# EasyEDA Pro project logic_G1.epro, board PCB2
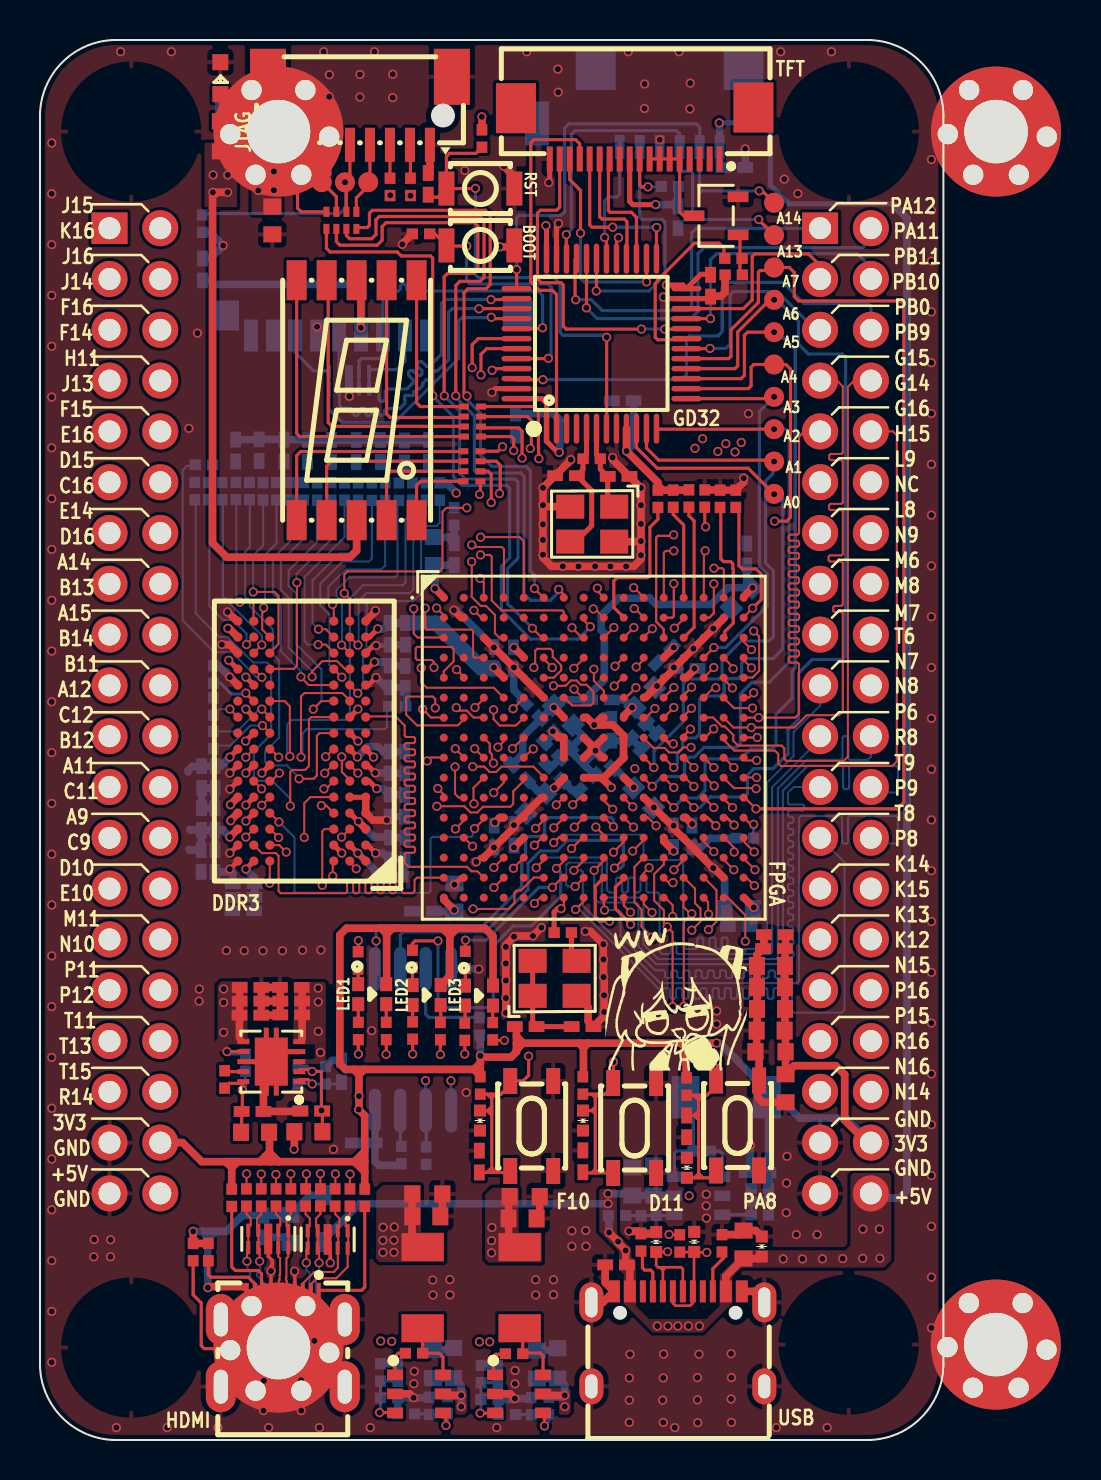
[diagram p10: board, top side]
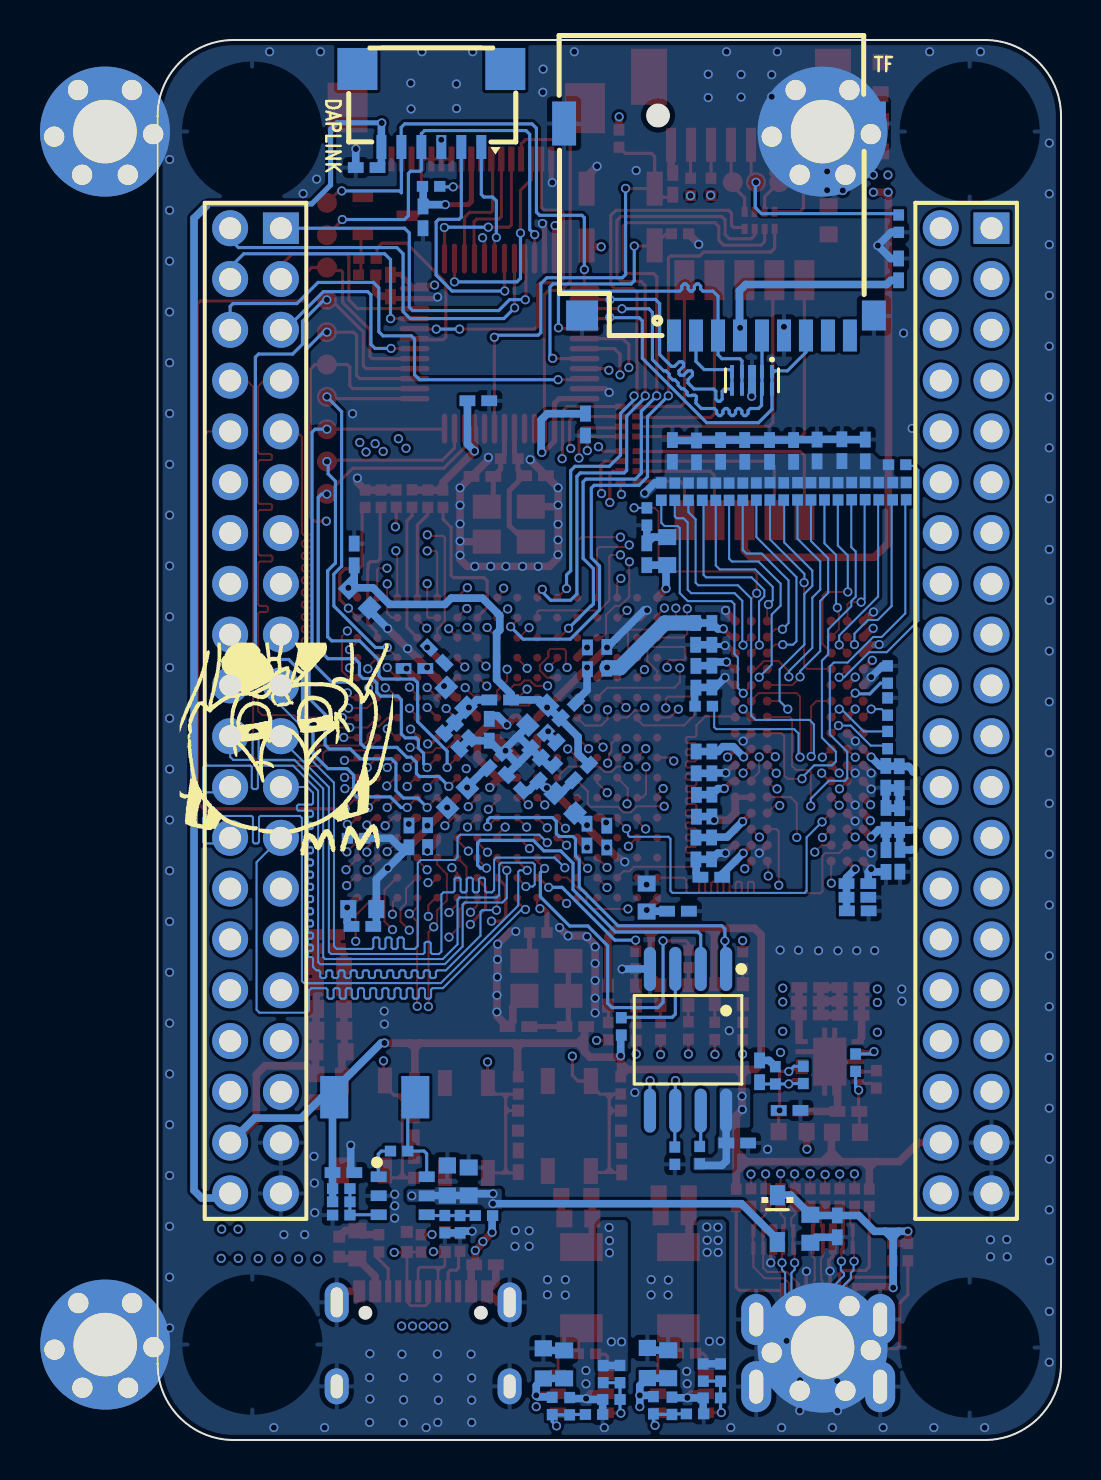
[diagram p11: board, bottom side, seen from below]

Outline 45.2 x 70 mm; copper layers: Top Layer, GND, SIN1, SIN2, PWR, Bottom Layer. Coordinates in mm from the lower left corner of the outline.
Outline path: 0,66.19 arc(1.12,68.88) 3.81,70 41.39,70 arc(44.08,68.88) 45.2,66.19 45.2,3.81 arc(44.08,1.12) 41.39,0 3.81,0 arc(1.12,1.12) 0,3.81 0,66.19
Stack: Top Layer 0.035mm 外层铜厚1oz / Dielectric1 0.0994mm 3313 RC57% 4.2mil / GND 0.0152mm 内层铜厚 / Dielectric2 0.55mm 0.55mm H/H No copper / SIN1 0.0152mm 内层铜厚 / Dielectric3 0.1088mm 2116 RC54% 4.9mil / SIN2 0.0152mm 内层铜厚 / Dielectric4 0.55mm 0.55mm H/H No copper / PWR 0.0152mm 内层铜厚 / Dielectric5 0.0994mm 3313 RC57% 4.2mil / Bottom Layer 0.035mm 外层铜厚1oz

## Design rules (mm)
net GND: PWR
net +5V_IN: PWR
net +3.3V: PWR
net VTT_DRAM: PWR
net +1.5V: PWR
net HDMI_5V: PWR
net VREF_DRAM: PWR
net VCCPLLL: PWR
net VCCPLLR: PWR
net +1.0V: PWR
net PB4/SPI2_MISO: TF_CARD
net PB3/SPI2_SCK: TF_CARD
net PB5/SPI2_MOSI: TF_CARD
net PA15/SPI2_NSS: TF_CARD
net HDMI_DATA2_P: HDMI_DATA2_
net HDMI_DATA2_N: HDMI_DATA2_
net HDMI_DATA1_P: HDMI_DATA1_
net HDMI_DATA1_N: HDMI_DATA1_
net HDMI_DATA0_P: HDMI_DATA0_
net HDMI_DATA0_N: HDMI_DATA0_
net HDMI_CLK_P: HDMI_CLK_
net HDMI_CLK_N: HDMI_CLK_
net M15_IOT40B: USB
net M14_IOT40A: USB
net EX_IOT24B_K16: BANK0, IOT24
net EX_IOT24A_J15: BANK0, IOT24
net EX_IOT22B_J14: BANK0, IOT22
net EX_IOT22A_J16: BANK0, IOT22
net EX_IOT9A_F14: BANK0, IOT9
net EX_IOT9B_F16: BANK0, IOT9
net EX_IOT27B_J13: BANK0, IOT27
net EX_IOT27A_H11: BANK0, IOT27
net EX_IOT6A_E16: BANK0, IOT6
net EX_IOT6B_F15: BANK0, IOT6
net EX_IOT5A_C16: BANK0, IOT5
net EX_IOT5B_D15: BANK0, IOT5
net EX_IOT4A_D16: BANK0, IOT4
net EX_IOT4B_E14: BANK0, IOT4
net EX_IOL8A_B13: BANK7, IOL8
net EX_IOL8B_A14: BANK7, IOL8
net EX_IOL2A_B14: BANK7, IOL2
net EX_IOL2B_A15: BANK7, IOL2
net EX_IOL13B_A12: BANK7, IOL13
net EX_IOL13A_B11: BANK7, IOL13
net EX_IOL7B_B12: BANK7, IOL7
net EX_IOL7A_C12: BANK7, IOL7
net EX_IOL15B_C11: BANK7, IOL15
net EX_IOL15A_A11: BANK7, IOL15
net EX_IOL27B_C9: BANK7, IOL27
net EX_IOL27A_A9: BANK7, IOL27
net EX_IOL17B_E10: BANK7, IOL17
net EX_IOL17A_D10: BANK7, IOL17
net EX_IOR27A_N10: IOR27
net EX_IOR27B_M11: IOR27
net EX_IOR8A_P12: IOR8
net EX_IOR24B_P11: IOR24
net EX_IOR8B_T13: IOR8
net EX_IOR24A_T11: IOR24
net EX_IOR7B_R14: IOR7
net EX_IOR7A_T15: IOR7
net EX_IOT13A_G15: IOT13
net EX_IOT13B_G14: IOT13
net EX_IOT16A_G16: IOT16
net EX_IOT16B_H15: IOT16
net EX_IOR40B_L9: BANK3
net EX_IOR44B_L8: BANK3
net EX_IOR36B_N9: BANK3
net EX_IOR44A_M6: BANK3
net EX_IOR36A_M8: BANK3
net EX_IOR47A_M7: BANK3
net EX_IOR53B_T6: BANK3
net EX_IOR47B_N7: BANK3
net EX_IOR40A_N8: BANK3
net EX_IOR53A_P6: BANK3
net EX_IOR29B_R8: BANK3
net EX_IOR38A_T9: BANK3
net EX_IOR38B_P9: BANK3
net EX_IOR42B_T8: BANK3
net EX_IOR42A_P8: BANK3
net EX_IOT30A_K14: BANK1, IOT30
net EX_IOT30B_K15: BANK1, IOT30
net EX_IOT36A_K13: BANK1, IOT36
net EX_IOT36B_K12: BANK1, IOT36
net EX_IOT48A_N15: BANK1, IOT48
net EX_IOT48B_P16: BANK1, IOT48
net EX_IOT54A_P15: BANK1, IOT54
net EX_IOT54B_R16: BANK1, IOT54
net EX_IOT52A_N16: BANK1, IOT52
net EX_IOT52B_N14: BANK1, IOT52
net DDR3_CKN: ADDR, DDR3_CK
net DDR3_CKP: ADDR, DDR3_CK
net DDR3_RSTN: ADDR
net DDR3_A13: ADDR
net DDR3_A12: ADDR
net DDR3_A11: ADDR
net DDR3_A10: ADDR
net DDR3_A9: ADDR
net DDR3_A8: ADDR
net DDR3_A7: ADDR
net DDR3_A6: ADDR
net DDR3_A5: ADDR
net DDR3_A4: ADDR
net DDR3_A3: ADDR
net DDR3_A2: ADDR
net DDR3_A1: ADDR
net DDR3_A0: ADDR
net DDR3_BA2: ADDR
net DDR3_BA1: ADDR
net DDR3_BA0: ADDR
net DDR3_CASN: ADDR
net DDR3_RASN: ADDR
net DDR3_WEN: ADDR
net DDR3_CSN: ADDR
net DDR3_CK_EN: ADDR
net LVDS_IOR11_P: LVDS, LVDS_IOR11_
net LVDS_IOR11_N: LVDS, LVDS_IOR11_
net LVDS_IOR17_P: LVDS, LVDS_IOR17_
net LVDS_IOR17_N: LVDS, LVDS_IOR17_
net LVDS_IOR20_P: LVDS, LVDS_IOR20_
net LVDS_IOR20_N: LVDS, LVDS_IOR20_
net LVDS_IOR22_P: LVDS, LVDS_IOR22_
net LVDS_IOR22_N: LVDS, LVDS_IOR22_
net DDR3_DQ5: DQ_0-7
net DDR3_DQ6: DQ_0-7
net DDR3_LDM: DQ_0-7
net DDR3_DQ11: DQ_8-15
net DDR3_DQ14: DQ_8-15
net DDR3_DQ4: DQ_0-7
net DDR3_LDQSP: DQ_0-7, DDR3_LDQS
net DDR3_DQ15: DQ_8-15
net DDR3_DQ10: DQ_8-15
net DDR3_DQ7: DQ_0-7
net DDR3_DQ3: DQ_0-7
net DDR3_LDQSN: DQ_0-7, DDR3_LDQS
net DDR3_DQ13: DQ_8-15
net DDR3_DQ8: DQ_8-15
net DDR3_ODT: ADDR
net DDR3_DQ2: DQ_0-7
net DDR3_DQ9: DQ_8-15
net DDR3_DQ12: DQ_8-15
net DDR3_DQ1: DQ_0-7
net DDR3_DQ0: DQ_0-7
net DDR3_UDQSP: DQ_8-15, DDR3_UDQS
net DDR3_UDM: DQ_8-15
net DDR3_UDQSN: DQ_8-15, DDR3_UDQS
template: 自定义配置
spacing 3W: track to track 0.295, other pairs 0.102 to 0.3
spacing deflaut (default): track to track 0.152, other pairs 0.102 to 0.3
spacing TF_CARD: track to track 0.152, other pairs 0 to 0.3
track width PWR: min 0.127, default 0.381, max 2.54
track width 100ohm: min 0.102, default 0.102, max 2.54
track width 90ohm: min 0.127, default 0.132, max 2.54
track width 50ohm (default): min 0.109, default 0.157, max 0.254
differential pair 100ohm (default): width min 0.102, default 0.102, max 0.254; gap min 0.152, default 0.152
differential pair 90ohm: width min 0.127, default 0.132, max 2.54; gap min 0.152, default 0.152
via viaSize (default): diameter min 0.457, default 0.457, max 0.457; hole min 0.305, default 0.305, max 0.305
net class PWR uses PWR
net class BANK0 uses 100ohm
net class BANK7 uses 100ohm
net class BANK3 uses 100ohm
net class BANK1 uses 100ohm
net class ADDR uses 100ohm, 3W
net class LVDS uses 3W
net class DQ_0-7 uses 100ohm, 3W
net class DQ_8-15 uses 100ohm, 3W
net GND uses PWR
net +5V_IN uses PWR
net +3.3V uses PWR
net VTT_DRAM uses PWR
net +1.5V uses PWR
net HDMI_5V uses PWR
net VREF_DRAM uses PWR
net VCCPLLL uses PWR
net VCCPLLR uses PWR
net +1.0V uses PWR
net PB4/SPI2_MISO uses TF_CARD
net PB3/SPI2_SCK uses TF_CARD
net PB5/SPI2_MOSI uses TF_CARD
net PA15/SPI2_NSS uses TF_CARD
net M15_IOT40B uses 90ohm
net M14_IOT40A uses 90ohm
net EX_IOT24B_K16 uses 100ohm, BANK0
net EX_IOT24A_J15 uses 100ohm, BANK0
net EX_IOT22B_J14 uses 100ohm, BANK0
net EX_IOT22A_J16 uses 100ohm, BANK0
net EX_IOT9A_F14 uses 100ohm, BANK0
net EX_IOT9B_F16 uses 100ohm, BANK0
net EX_IOT27B_J13 uses 100ohm, BANK0
net EX_IOT27A_H11 uses 100ohm, BANK0
net EX_IOT6A_E16 uses 100ohm, BANK0
net EX_IOT6B_F15 uses 100ohm, BANK0
net EX_IOT5A_C16 uses 100ohm, BANK0
net EX_IOT5B_D15 uses 100ohm, BANK0
net EX_IOT4A_D16 uses 100ohm, BANK0
net EX_IOT4B_E14 uses 100ohm, BANK0
net EX_IOL8A_B13 uses 100ohm, BANK7
net EX_IOL8B_A14 uses 100ohm, BANK7
net EX_IOL2A_B14 uses 100ohm, BANK7
net EX_IOL2B_A15 uses 100ohm, BANK7
net EX_IOL13B_A12 uses 100ohm, BANK7
net EX_IOL13A_B11 uses 100ohm, BANK7
net EX_IOL7B_B12 uses 100ohm, BANK7
net EX_IOL7A_C12 uses 100ohm, BANK7
net EX_IOL15B_C11 uses 100ohm, BANK7
net EX_IOL15A_A11 uses 100ohm, BANK7
net EX_IOL27B_C9 uses 100ohm, BANK7
net EX_IOL27A_A9 uses 100ohm, BANK7
net EX_IOL17B_E10 uses 100ohm, BANK7
net EX_IOL17A_D10 uses 100ohm, BANK7
net EX_IOT16A_G16 uses 100ohm
net EX_IOT16B_H15 uses 100ohm
net EX_IOR40B_L9 uses 100ohm, BANK3
net EX_IOR44B_L8 uses 100ohm, BANK3
net EX_IOR36B_N9 uses 100ohm, BANK3
net EX_IOR44A_M6 uses 100ohm, BANK3
net EX_IOR36A_M8 uses 100ohm, BANK3
net EX_IOR47A_M7 uses 100ohm, BANK3
net EX_IOR53B_T6 uses 100ohm, BANK3
net EX_IOR47B_N7 uses 100ohm, BANK3
net EX_IOR40A_N8 uses 100ohm, BANK3
net EX_IOR53A_P6 uses 100ohm, BANK3
net EX_IOR29B_R8 uses 100ohm, BANK3
net EX_IOR38A_T9 uses 100ohm, BANK3
net EX_IOR38B_P9 uses 100ohm, BANK3
net EX_IOR42B_T8 uses 100ohm, BANK3
net EX_IOR42A_P8 uses 100ohm, BANK3
net EX_IOT30A_K14 uses 100ohm, BANK1
net EX_IOT30B_K15 uses 100ohm, BANK1
net EX_IOT36A_K13 uses 100ohm, BANK1
net EX_IOT36B_K12 uses 100ohm, BANK1
net EX_IOT48A_N15 uses 100ohm, BANK1
net EX_IOT48B_P16 uses 100ohm, BANK1
net EX_IOT54A_P15 uses 100ohm, BANK1
net EX_IOT54B_R16 uses 100ohm, BANK1
net EX_IOT52A_N16 uses 100ohm, BANK1
net EX_IOT52B_N14 uses 100ohm, BANK1
net DDR3_CKN uses 100ohm, 3W
net DDR3_CKP uses 100ohm, 3W
net DDR3_RSTN uses 100ohm, 3W
net DDR3_A13 uses 100ohm, 3W
net DDR3_A12 uses 100ohm, 3W
net DDR3_A11 uses 100ohm, 3W
net DDR3_A10 uses 100ohm, 3W
net DDR3_A9 uses 100ohm, 3W
net DDR3_A8 uses 100ohm, 3W
net DDR3_A7 uses 100ohm, 3W
net DDR3_A6 uses 100ohm, 3W
net DDR3_A5 uses 100ohm, 3W
net DDR3_A4 uses 100ohm, 3W
net DDR3_A3 uses 100ohm, 3W
net DDR3_A2 uses 100ohm, 3W
net DDR3_A1 uses 100ohm, 3W
net DDR3_A0 uses 100ohm, 3W
net DDR3_BA2 uses 100ohm, 3W
net DDR3_BA1 uses 100ohm, 3W
net DDR3_BA0 uses 100ohm, 3W
net DDR3_CASN uses 100ohm, 3W
net DDR3_RASN uses 100ohm, 3W
net DDR3_WEN uses 100ohm, 3W
net DDR3_CSN uses 100ohm, 3W
net DDR3_CK_EN uses 100ohm, 3W
net LVDS_IOR11_P uses 3W, LVDS
net LVDS_IOR11_N uses 3W, LVDS
net LVDS_IOR17_P uses 3W, LVDS
net LVDS_IOR17_N uses 3W, LVDS
net LVDS_IOR20_P uses 3W, LVDS
net LVDS_IOR20_N uses 3W, LVDS
net LVDS_IOR22_P uses 3W, LVDS
net LVDS_IOR22_N uses 3W, LVDS
net DDR3_DQ5 uses 100ohm, 3W, DDR_0-7
net DDR3_DQ6 uses 100ohm, 3W, DDR_0-7
net DDR3_LDM uses 100ohm, 3W, DDR_0-7
net DDR3_DQ11 uses 100ohm, 3W, DDR_8-15
net DDR3_DQ14 uses 100ohm, 3W, DDR_8-15
net DDR3_DQ4 uses 100ohm, 3W, DDR_0-7
net DDR3_LDQSP uses 100ohm, 3W, DDR_0-7
net DDR3_DQ15 uses 100ohm, 3W, DDR_8-15
net DDR3_DQ10 uses 100ohm, 3W, DDR_8-15
net DDR3_DQ7 uses 100ohm, 3W, DDR_0-7
net DDR3_DQ3 uses 100ohm, 3W, DDR_0-7
net DDR3_LDQSN uses 100ohm, 3W, DDR_0-7
net DDR3_DQ13 uses 100ohm, 3W, DDR_8-15
net DDR3_DQ8 uses 100ohm, 3W, DDR_8-15
net DDR3_ODT uses 100ohm, 3W
net DDR3_DQ2 uses 100ohm, 3W, DDR_0-7
net DDR3_DQ9 uses 100ohm, 3W, DDR_8-15
net DDR3_DQ12 uses 100ohm, 3W, DDR_8-15
net DDR3_DQ1 uses 100ohm, 3W, DDR_0-7
net DDR3_DQ0 uses 100ohm, 3W, DDR_0-7
net DDR3_UDQSP uses 100ohm, 3W, DDR_8-15
net DDR3_UDM uses 100ohm, 3W, DDR_8-15
net DDR3_UDQSN uses 100ohm, 3W, DDR_8-15
diff pair USB uses 90ohm
eq len grp TF_CARD uses TF_CARD
eq len grp BANK0 uses BANK0
eq len grp BANK7 uses BANK7
eq len grp BANK3 uses BANK3
eq len grp BANK1 uses BANK1
eq len grp LVDS uses LVDS
eq len grp DQ_0-7 uses DDR_0-7
eq len grp DQ_8-15 uses DDR_8-15
region e40391 uses TF_CARD
region e40392 uses TF_CARD

## Placement (name value [footprint] x y rotation side)
C1  18pF  [C0402]  26.31 48.21 180 top
C2  18pF  [C0402]  28.95 48.18 180 top
C21  22uF  [C0603]  11.62 60.98 90 top
C22  100nF  [C0402]  31.23 39.24 45 bottom
C23  100nF  [C0402]  18.24 49.43 90 bottom
C27  100nF  [C0402]  8.09 33.14 90 bottom
C31  100nF  [C0402]  8.76 31.06 270 bottom
C32  100nF  [C0402]  10.17 26.46 0 bottom
C33  100nF  [C0402]  8.77 33.16 90 bottom
C34  100nF  [C0402]  8.76 28.95 90 bottom
C35  100nF  [C0402]  10.19 27.13 0 bottom
C56  100nF  [C0402]  27.14 20.67 180 top
C57  100nF  [C0402]  16.2 14.85 180 bottom
C68  100nF  [C0402]  11.19 10.68 270 bottom
C69  10uF  [C0603]  12.54 10.56 90 bottom
C72  100nF  [C0402]  27.16 13.93 90 top
C73  100nF  [C0402]  21.98 13.92 90 top
C74  2.2uF  [C0402]  10.63 16.43 0 top
C75  10uF  [C0402]  13.57 16.44 0 top
C76  10uF  [C0402]  13.58 16.48 0 bottom
C77  100nF  [C0402]  10.53 21.24 0 top
C81  2.2uF  [C0402]  12.55 22.63 0 top
C82  2.2uF  [C0402]  10.96 49.49 270 bottom
C83  2.2uF  [C0402]  14.58 49.45 270 bottom
C84  100nF  [C0402]  12.21 49.48 90 bottom
C85  100nF  [C0402]  9.79 49.48 90 bottom
C88  100nF  [C0402]  10.53 22.63 0 top
C89  100nF  [C0402]  10.53 21.94 0 top
C91  100nF  [C0402]  22.73 30.17 90 bottom
C92  100nF  [C0402]  26.15 34.97 135 bottom
C96  2.2uF  [C0402]  18.27 38.16 90 bottom
C97  2.2uF  [C0402]  17.47 38.17 90 bottom
C98  2.2uF  [C0402]  17.47 40.31 90 bottom
C99  2.2uF  [C0402]  17.47 33.88 90 bottom
C100  100nF  [C0402]  17.47 31.72 90 bottom
C101  100nF  [C0402]  18.28 40.31 90 bottom
C102  100nF  [C0402]  17.48 29.58 90 bottom
C103  100nF  [C0402]  18.25 33.88 90 bottom
C104  100nF  [C0402]  18.26 29.57 90 bottom
C105  100nF  [C0402]  8.06 28.96 90 bottom
C114  100nF  [C0402]  35.9 13.37 0 bottom
C115  100nF  [C0402]  32.62 30.18 90 bottom
C116  100nF  [C0402]  31.69 30.2 270 bottom
C117  22uF  [C0603]  35.2 9.77 270 top
C118  100nF  [C0402]  28.82 8.76 0 top
C119  1nF  [C0402]  15.08 18.44 270 bottom
C123  100nF  [C0402]  32.35 38.58 0 bottom
C124  100nF  [C0402]  28.61 35.51 90 bottom
C126  10uF  [C0603]  30.26 37.13 225 bottom
C127  1nF  [C0402]  30.48 34.94 45 bottom
C128  100nF  [C0402]  29.94 35.47 45 bottom
C130  10uF  [C0603]  24.81 31.84 45 bottom
C131  1nF  [C0402]  27.35 32.87 225 bottom
C132  100nF  [C0402]  25.75 33.35 315 bottom
C134  10uF  [C0402]  12.56 21.26 0 top
C135  10uF  [C0402]  13.38 49.45 270 bottom
C136  10uF  [C0402]  12.57 21.94 0 top
C137  100nF  [C0402]  17.03 49.45 90 bottom
C138  100nF  [C0402]  19.44 49.45 90 bottom
C139  100nF  [C0402]  15.83 49.45 90 bottom
C140  100nF  [C0402]  10.19 27.82 0 bottom
C141  100nF  [C0402]  18.24 31.71 90 bottom
C142  100nF  [C0402]  17.49 28.14 180 bottom
C143  100nF  [C0402]  23.72 30.27 270 bottom
C144  100nF  [C0402]  23.69 39.09 90 bottom
C145  100nF  [C0402]  22.73 39.11 270 bottom
C146  100nF  [C0402]  25.63 34.49 135 bottom
C147  100nF  [C0402]  8.07 31.05 270 bottom
C148  22uF  [C0603]  20.73 27.12 270 bottom
C149  22uF  [C0603]  19.7 44.45 270 bottom
C150  22uF  [C0603]  26.18 36.24 135 bottom
C151  10uF  [C0603]  30.19 32.11 135 bottom
C152  10uF  [C0603]  35.09 42.11 45 bottom
C153  10uF  [C0603]  34.95 26.54 0 bottom
C154  100nF  [C0402]  34.95 25.68 0 bottom
C155  100nF  [C0402]  28.26 33.98 315 bottom
C156  100nF  [C0402]  20.73 44.29 270 bottom
C157  100nF  [C0402]  24.65 36.48 315 bottom
C158  100nF  [C0402]  35.36 44.28 270 bottom
C159  100nF  [C0402]  19.16 26.44 0 bottom
C160  22uF  [C0603]  37.3 17.59 90 top
C161  22uF  [C0603]  36.57 22.64 0 top
C162  10uF  [C0603]  36.57 21.55 0 top
C163  10uF  [C0603]  36.57 23.71 0 top
C164  100nF  [C0402]  36.76 25.27 0 top
C165  100nF  [C0402]  36.72 24.57 0 top
C166  100nF  [C0402]  8.13 58.53 270 bottom
C167  100nF  [C0402]  19.42 62.81 270 top
C168  100nF  [C0402]  23.79 50.77 90 bottom
C169  100nF  [C0402]  29.15 51.96 0 bottom
C170  100nF  [C0402]  33.55 57.71 90 top
C171  100nF  [C0402]  34.74 63.62 180 bottom
C172  100nF  [C0402]  32.35 15.68 90 top
C173  100nF  [C0402]  31.92 61.13 90 bottom
C174  100nF  [R0603]  30.7 12.97 270 bottom
C175  100nF  [R0402]  30.83 10.79 90 bottom
C176  100nF  [R0402]  33.11 14.45 0 bottom
C177  22pF  [R0402]  36.01 11.91 0 bottom
C178  22uF  [C0603]  36.55 20.47 0 top
C179  100nF  [R0603]  36.55 19.41 0 top
C180  10uF  [C0603]  29.63 12.92 270 bottom
C181  100nF  [R0603]  20.69 3.85 270 bottom
C182  100nF  [R0402]  18.31 1.31 0 bottom
C183  100nF  [R0402]  18.71 4.34 180 top
C184  22pF  [R0402]  17.9 3.37 90 bottom
C185  22uF  [C0603]  19.33 11.19 180 top
C186  100nF  [R0603]  19.38 12.3 180 top
C187  10uF  [C0603]  19.65 3.79 270 bottom
C188  100nF  [R0603]  25.9 3.83 270 bottom
C189  100nF  [R0402]  23.36 1.28 0 bottom
C190  100nF  [R0402]  23.72 4.31 180 top
C191  22pF  [R0402]  22.9 3.3 90 bottom
C192  22uF  [C0603]  24.15 11.08 180 top
C193  100nF  [R0603]  24.25 12.17 180 top
C194  10uF  [C0603]  24.86 3.78 270 bottom
CARD2  TF PUSH  [TF-SMD_TF-PUSH]  17.11 60.52 0 bottom
CN1  WAFER-100W-6A  [CONN-SMD_6P-P1.00_XUNPU_WAFER-100W-6P]  31.5 66.6 0 bottom
D4  1N5819WS  [SOD-323_L1.8-W1.3-LS2.5-RD]  14.19 11.07 270 bottom
D6  0402ESDA-05N  [D0402-BI]  27.17 15.97 90 top
D7  0402ESDA-05N  [D0402-BI]  22.01 15.97 90 top
D8  0402ESDA-05N  [D0402-BI]  36.11 9.67 270 top
D9  RCLAMP0524P  [DFN2510-10_L2.5-W1.0-P0.50-BL]  14.39 10.03 180 top
D10  RCLAMP0524P  [DFN2510-10_L2.5-W1.0-P0.50-BL]  11.42 10.05 180 top
D11  RCLAMP0524P  [DFN2510-10_L2.5-W1.0-P0.50-BL]  15.46 52.98 0 bottom
D12  0402ESDA-05N  [D0402-BI]  32.36 13.61 270 top
E1  0402ESDA-05N  [D0402-BI]  30.83 9.9 270 top
E2  0402ESDA-05N  [D0402-BI]  32.73 9.91 270 top
FPC1  FPC-05F-18PH20  [FPC-SMD_18P-P0.50_FPC-05F-18PH20]  29.75 65.34 180 top
H1  -  [125 X 300]  4.57 4.62 0 top
H2  -  [125 X 300]  40.45 4.77 0 top
H3  -  [125 X 300]  40.47 65.42 0 top
H4  -  [125 X 300]  4.57 65.42 0 top
H5  12251220ANG0S115001  [HDR-TH_40P-P2.54-V-M-R2-C20-S2.54]  4.75 36.46 270 top
H6  12251220ANG0S115001  [HDR-TH_40P-P2.54-V-M-R2-C20-S2.54]  40.3 36.46 270 top
L2  3.3uH  [IND-SMD_L4.4-W4.2]  34.33 17.14 180 bottom
L8  MPZ1608S101ATAH0  [L0603]  13.43 15.41 180 top
L9  MPZ1608S101ATAH0  [L0603]  10.76 15.39 0 top
L12  UPZ1005D121-1R3TF  [L0402]  28.06 37 0 bottom
L13  UPZ1005D121-1R3TF  [L0402]  23.99 33.37 315 bottom
L16  UPZ1005D121-1R3TF  [L0402]  24.3 20.67 0 top
L17  3.3uH  [IND-SMD_L4.4-W4.2]  19.14 7.62 270 top
L18  3.3uH  [IND-SMD_L4.4-W4.2]  23.99 7.62 270 top
LED1  E6C0606RGBC3UDA  [LED-SMD_4P-L1.6-W1.6-TL-FD]  16.62 22.29 0 top
LED2  E6C0606RGBC3UDA  [LED-SMD_4P-L1.6-W1.6-TL-FD]  21.96 22.22 0 top
LED3  E6C0606RGBC3UDA  [LED-SMD_4P-L1.6-W1.6-TL-FD]  19.35 22.25 0 top
LED4  F.0603.00139/P2-0603R1TS2-06T-002  [LED0603-RD]  9.03 68.09 270 top
LED6  SLS0281FR1A1GD  [LED-SEG-SMD_SLS0281FR1A1GD]  15.84 51.99 0 top
NC1  10kΩ  [R0402]  34.71 58.26 0 top
Q1  S8050 J3Y  [SOT-23-3_L3.0-W1.7-P0.95-LS2.9-BR]  33.82 61.21 0 top
R1  1MΩ  [R0402]  27.6 49.07 180 top
R2  10kΩ  [R0402]  22.11 65.07 90 top
R4  10kΩ  [R0402]  19.06 60.31 0 top
R6  10kΩ  [R0402]  32.35 17.67 90 top
R7  10Ω  [R0402]  31.51 62.68 0 bottom
R8  1kΩ  [R0402]  34.69 59.08 180 top
R9  10kΩ  [R0402]  33.26 47.07 90 top
R17  22Ω  [R0402]  26.15 25.37 180 top
R18  33Ω  [R0402]  17.51 62.66 270 top
R19  33Ω  [R0402]  18.53 62.66 270 top
R20  4.7kΩ  [R0402]  8.12 60.82 90 bottom
R30  4.7kΩ  [R0402]  18.08 14.24 90 bottom
R31  4.7kΩ  [R0402]  22 20.68 270 bottom
R36  47kΩ  [R0402]  28.87 11.22 180 bottom
R37  15kΩ  [R0402]  36.01 12.57 0 bottom
R40  3.3kΩ  [R0402]  36.01 11.25 180 bottom
R61  10kΩ  [R0402]  27.16 17.73 90 top
R73  0Ω  [R0402]  10.28 18.87 90 bottom
R74  100kΩ  [R0402]  9.24 18.03 90 top
R75  10kΩ  [R0402]  12.89 18.26 90 bottom
R76  10kΩ  [R0402]  14.29 18.23 270 bottom
R103  5.1kΩ  [R0402]  34.12 9.84 90 top
R104  5.1kΩ  [R0402]  30.07 9.88 90 top
R106  100Ω  [R0402]  8.68 35 90 bottom
R109  1kΩ  [R0402]  20.72 46.17 90 bottom
R110  49.9Ω  [R0402]  17.27 47.42 90 bottom
R111  49.9Ω  [R0402]  14.56 47.43 90 bottom
R112  49.9Ω  [R0402]  11.84 47.44 90 bottom
R113  49.9Ω  [R0402]  18.64 47.42 90 bottom
R114  49.9Ω  [R0402]  15.92 47.42 90 bottom
R115  49.9Ω  [R0402]  9.8 47.45 90 bottom
R116  49.9Ω  [R0402]  19.32 47.42 90 bottom
R117  49.9Ω  [R0402]  8.43 47.44 90 bottom
R118  49.9Ω  [R0402]  17.95 47.42 90 bottom
R119  49.9Ω  [R0402]  9.12 47.44 90 bottom
R120  49.9Ω  [R0402]  13.18 47.43 270 bottom
R121  49.9Ω  [R0402]  15.24 47.42 270 bottom
R122  49.9Ω  [R0402]  11.15 47.43 270 bottom
R123  49.9Ω  [R0402]  16.61 47.42 270 bottom
R124  49.9Ω  [R0402]  12.51 47.44 270 bottom
R125  49.9Ω  [R0402]  8.2 48.76 180 bottom
R126  49.9Ω  [R0402]  20 47.42 270 bottom
R127  49.9Ω  [R0402]  7.74 47.45 90 bottom
R128  49.9Ω  [R0402]  10.47 47.45 90 bottom
R129  49.9Ω  [R0402]  13.88 47.43 90 bottom
R130  1kΩ  [R0402]  17.87 36.69 180 bottom
R131  1kΩ  [R0402]  8.68 36.67 270 bottom
R132  240Ω  [R0402]  8.68 38.27 270 bottom
R133  4.7kΩ  [R0402]  34.81 47.06 90 top
R134  4.7kΩ  [R0402]  34.02 47.06 90 top
R135  4.7kΩ  [R0402]  35.27 30.09 180 bottom
R136  4.7kΩ  [R0402]  30.92 47.06 270 top
R137  4.7kΩ  [R0402]  31.68 47.06 270 top
R138  4.7kΩ  [R0402]  32.46 47.07 270 top
R143  0Ω  [R0402]  15.51 12.13 90 top
R144  0Ω  [R0402]  14.77 12.13 90 top
R145  0Ω  [R0402]  14.03 12.13 90 top
R146  0Ω  [R0402]  13.29 12.13 90 top
R147  0Ω  [R0402]  12.55 12.13 90 top
R148  0Ω  [R0402]  11.81 12.13 90 top
R149  0Ω  [R0402]  11.07 12.13 90 top
R150  0Ω  [R0402]  10.33 12.13 90 top
R151  1kΩ  [R0402]  19.32 14.22 90 bottom
R152  10kΩ  [R0402]  7.66 9.39 90 top
R153  10kΩ  [R0402]  8.42 9.39 90 top
R154  10kΩ  [R0402]  9.59 12.11 90 top
R155  10kΩ  [R0402]  16.25 12.11 90 top
R156  30kΩ  [R0402]  30.07 10.79 90 bottom
R157  47kΩ  [R0402]  20.39 1.74 90 bottom
R158  30kΩ  [R0402]  19.47 1.71 270 bottom
R161  47kΩ  [R0402]  25.46 1.7 90 bottom
R162  30kΩ  [R0402]  24.58 1.69 270 bottom
R163  12kΩ  [R0402]  22.06 3.3 90 bottom
R164  18kΩ  [R0402]  22.5 2.03 180 bottom
R165  12kΩ  [R0402]  17.47 2.1 180 bottom
R166  18kΩ  [R0402]  17.04 3.37 90 bottom
R167  3kΩ  [R0402]  17.32 20.45 90 top
R168  4.3kΩ  [R0402]  15.92 23.98 90 top
R169  9.1kΩ  [R0402]  15.93 20.45 270 top
R170  3kΩ  [R0402]  22.65 20.44 90 top
R171  4.3kΩ  [R0402]  21.28 24 90 top
R172  9.1kΩ  [R0402]  21.25 20.41 270 top
R173  3kΩ  [R0402]  20.03 20.44 90 top
R174  4.3kΩ  [R0402]  18.63 24.06 90 top
R175  9.1kΩ  [R0402]  18.64 20.47 270 top
R176  4.7kΩ  [R0603]  9.03 65.18 270 top
R177  1.5kΩ  [R0402]  32.01 9.83 90 top
R178  10kΩ  [R0402]  22.03 17.73 90 top
RN1  33Ω  [RES-ARRAY-SMD_0402-8P-L2.0-W1.0-BL]  15.08 60.98 0 top
RN4  510Ω  [RES-ARRAY-SMD_0402-8P-L2.0-W1.0-BL]  21.63 50.92 270 top
RN5  510Ω  [RES-ARRAY-SMD_0402-8P-L2.0-W1.0-BL]  21.61 48.69 90 top
SW1  PTS815SJK250SMTRLFS  [SW-SMD_4P-L4.2-W3.3-P2.15-LS5.1]  34.9 15.73 90 top
SW2  PTS815SJK250SMTRLFS  [SW-SMD_4P-L4.2-W3.3-P2.15-LS5.1]  29.75 15.6 90 top
SW3  PTS815SJK250SMTRLFS  [SW-SMD_4P-L4.2-W3.3-P2.15-LS5.1]  24.6 15.7 90 top
SW4  B3U-1000P  [KEY-SMD_B3U-1000PM]  22.03 62.57 180 top
SW5  B3U-1000P  [KEY-SMD_B3U-1000PM]  22.03 59.73 0 top
TP1  -  [Test-Point-0.5mm]  36.73 47.31 90 top
TP2  -  [Test-Point-0.5mm]  36.73 48.92 90 top
TP3  -  [Test-Point-0.5mm]  36.73 50.54 90 top
TP4  -  [Test-Point-0.5mm]  36.73 52.16 90 top
TP5  -  [Test-Point-0.5mm]  36.73 53.77 90 top
TP6  -  [Test-Point-0.5mm]  36.73 55.39 90 top
TP7  -  [Test-Point-0.5mm]  36.73 57.01 90 top
TP8  -  [Test-Point-0.5mm]  36.73 58.63 90 top
TP9  -  [Test-Point-0.5mm]  36.73 60.24 90 top
TP10  -  [Test-Point-0.5mm]  36.73 61.86 90 top
TP11  -  [Test-Point-0.5mm]  12.89 62.92 0 top
TP12  -  [Test-Point-0.5mm]  14.1 62.89 0 top
TP13  -  [Test-Point-0.5mm]  15.26 62.89 0 top
TP14  -  [Test-Point-0.5mm]  16.42 62.89 0 top
U1  GD32F303CBT6  [LQFP-48_L7.0-W7.0-P0.50-LS9.0-BL]  28.09 54.82 0 top
U2  SY8113BADC  [TSOT-23-6_L2.9-W1.6-P0.95-LS2.8-BR]  32.94 12.21 0 bottom
U7  -  [FBGA-256_L17.0-W17.0-R16-C16-P1.00-TL-1]  27.7 34.62 0 top
U20  ZX-SH1.0-8PWT  [CONN-SMD_8P-P1.00_MEGASTAR_ZX-SH1.0-8PWT]  16.01 66.46 180 top
U23  TPS51200DRCR  [WSON-10_L3.0-W3.0-P0.50-BL-EP]  11.57 18.92 90 top
U29  MT41J128M16JT-125-K  [FBGA-96_L14.0-W9.0-R16-C6-P0.80-TL]  13.1 34.95 180 top
U30  W25Q64JVSSIQ  [SOP-8_L5.3-W5.3-P1.27-LS8.0-BL]  18.66 20.01 0 bottom
U31  SY8113BADC  [TSOT-23-6_L2.9-W1.6-P0.95-LS2.8-BR]  18.97 2.31 180 top
U32  SY8113BADC  [TSOT-23-6_L2.9-W1.6-P0.95-LS2.8-BR]  23.97 2.31 180 top
USB2  TYPE-C 16PIN 2MD(073)  [USB-C-SMD_TYPE-C-6PIN-2MD-073]  31.91 5.06 0 top
USB3  -  [hdmi-smd_hdmi-101s]  12.15 5.05 0 top
X1  8MHz  [OSC-SMD_4P-L3.2-W2.5-BL]  27.63 45.79 180 top
X3  50MHz  [OSC-SMD_4P-L3.2-W2.5-BL]  25.75 23.08 0 top

## Footprints (pads in the part's own frame, mm; a bottom-side part is the same pattern mirrored in y, then rotated)
125 X 300
  round 1.016 hole 1.021x1.016: 1(4.95,-0.127) 1(6.017,2.078) 1(6.22,-2.159) 1(8.506,-2.159) 1(8.71,2.078) 1(9.903,-0.254)
  round 6.5 hole 3.18x3.175: 1(7.363,0)
C0402
  rect 0.79x0.54 smd: 1(-0.545,0) 2(0.545,0)
C0603
  rect 0.8x0.9 smd: 1(-0.7,0) 2(0.7,0)
CONN-SMD_6P-P1.00_XUNPU_WAFER-100W-6P
  rect 0.5x1.2 smd: 1(-2.5,1.95) 2(-1.5,1.95) 3(-0.5,1.95) 4(0.5,1.95) 5(1.5,1.95) 6(2.5,1.95)
  rect 2x2.1 smd: 7(3.7,-1.95) 8(-3.7,-1.95)
CONN-SMD_8P-P1.00_MEGASTAR_ZX-SH1.0-8PWT
  rect 0.5x1.7 smd: 1(-3.5,1.7) 2(-2.5,1.7) 3(-1.5,1.7) 4(-0.5,1.7) 5(0.5,1.7) 6(1.5,1.7) 7(2.5,1.7) 8(3.5,1.7)
  rect 1.8x2.8 smd: 9(4.6,-1.7) 10(-4.6,-1.7)
D0402-BI
  rect 0.6x0.6 smd: 1(-0.5,0) 2(0.5,0)
DFN2510-10_L2.5-W1.0-P0.50-BL
  rect 0.2x0.665 smd: 1(-1,-0.433) 2(-0.5,-0.433) 4(0.5,-0.433) 5(1,-0.433) 6(1,0.433) 7(0.5,0.433) 9(-0.5,0.433) 10(-1,0.433)
  rect 0.4x0.665 smd: 3(0,-0.433) 8(0,0.433)
FBGA-96_L14.0-W9.0-R16-C6-P0.80-TL
  round 0.457 smd: A1(-3.2,6) A2(-2.4,6) A3(-1.6,6) A7(1.6,6) A8(2.4,6) A9(3.2,6) B1(-3.2,5.2) B2(-2.4,5.2) B3(-1.6,5.2) B7(1.6,5.2) B8(2.4,5.2) B9(3.2,5.2) C1(-3.2,4.4) C2(-2.4,4.4) C3(-1.6,4.4) C7(1.6,4.4) C8(2.4,4.4) C9(3.2,4.4) D1(-3.2,3.6) D2(-2.4,3.6) D3(-1.6,3.6) D7(1.6,3.6) D8(2.4,3.6) D9(3.2,3.6) E1(-3.2,2.8) E2(-2.4,2.8) E3(-1.6,2.8) E7(1.6,2.8) E8(2.4,2.8) E9(3.2,2.8) F1(-3.2,2) F2(-2.4,2) F3(-1.6,2) F7(1.6,2) F8(2.4,2) F9(3.2,2) G1(-3.2,1.2) G2(-2.4,1.2) G3(-1.6,1.2) G7(1.6,1.2) G8(2.4,1.2) G9(3.2,1.2) H1(-3.2,0.4) H2(-2.4,0.4) H3(-1.6,0.4) H7(1.6,0.4) H8(2.4,0.4) H9(3.2,0.4) J1(-3.2,-0.4) J2(-2.4,-0.4) J3(-1.6,-0.4) J7(1.6,-0.4) J8(2.4,-0.4) J9(3.2,-0.4) K1(-3.2,-1.2) K2(-2.4,-1.2) K3(-1.6,-1.2) K7(1.6,-1.2) K8(2.4,-1.2) K9(3.2,-1.2) L1(-3.2,-2) L2(-2.4,-2) L3(-1.6,-2) L7(1.6,-2) L8(2.4,-2) L9(3.2,-2) M1(-3.2,-2.8) M2(-2.4,-2.8) M3(-1.6,-2.8) M7(1.6,-2.8) M8(2.4,-2.8) M9(3.2,-2.8) N1(-3.2,-3.6) N2(-2.4,-3.6) N3(-1.6,-3.6) N7(1.6,-3.6) N8(2.4,-3.6) N9(3.2,-3.6) P1(-3.2,-4.4) P2(-2.4,-4.4) P3(-1.6,-4.4) P7(1.6,-4.4) P8(2.4,-4.4) P9(3.2,-4.4) R1(-3.2,-5.2) R2(-2.4,-5.2) R3(-1.6,-5.2) R7(1.6,-5.2) R8(2.4,-5.2) R9(3.2,-5.2) T1(-3.2,-6) T2(-2.4,-6) T3(-1.6,-6) T7(1.6,-6) T8(2.4,-6) T9(3.2,-6)
FBGA-256_L17.0-W17.0-R16-C16-P1.00-TL-1
  round 0.4 smd: A1(-7.5,7.5) A2(-6.5,7.5) A3(-5.5,7.5) A4(-4.5,7.5) A5(-3.5,7.5) A6(-2.5,7.5) A7(-1.5,7.5) A8(-0.5,7.5) A9(0.5,7.5) A10(1.5,7.5) A11(2.5,7.5) A12(3.5,7.5) A13(4.5,7.5) A14(5.5,7.5) A15(6.5,7.5) A16(7.5,7.5) B1(-7.5,6.5) B2(-6.5,6.5) B3(-5.5,6.5) B4(-4.5,6.5) B5(-3.5,6.5) B6(-2.5,6.5) B7(-1.5,6.5) B8(-0.5,6.5) B9(0.5,6.5) B10(1.5,6.5) B11(2.5,6.5) B12(3.5,6.5) B13(4.5,6.5) B14(5.5,6.5) B15(6.5,6.5) B16(7.5,6.5) C1(-7.5,5.5) C2(-6.5,5.5) C3(-5.5,5.5) C4(-4.5,5.5) C5(-3.5,5.5) C6(-2.5,5.5) C7(-1.5,5.5) C8(-0.5,5.5) C9(0.5,5.5) C10(1.5,5.5) C11(2.5,5.5) C12(3.5,5.5) C13(4.5,5.5) C14(5.5,5.5) C15(6.5,5.5) C16(7.5,5.5) D1(-7.5,4.5) D2(-6.5,4.5) D3(-5.5,4.5) D4(-4.5,4.5) D5(-3.5,4.5) D6(-2.5,4.5) D7(-1.5,4.5) D8(-0.5,4.5) D9(0.5,4.5) D10(1.5,4.5) D11(2.5,4.5) D12(3.5,4.5) D13(4.5,4.5) D14(5.5,4.5) D15(6.5,4.5) D16(7.5,4.5) E1(-7.5,3.5) E2(-6.5,3.5) E3(-5.5,3.5) E4(-4.5,3.5) E5(-3.5,3.5) E6(-2.5,3.5) E7(-1.5,3.5) E8(-0.5,3.5) E9(0.5,3.5) E10(1.5,3.5) E11(2.5,3.5) E12(3.5,3.5) E13(4.5,3.5) E14(5.5,3.5) E15(6.5,3.5) E16(7.5,3.5) F1(-7.5,2.5) F2(-6.5,2.5) F3(-5.5,2.5) F4(-4.5,2.5) F5(-3.5,2.5) F6(-2.5,2.5) F7(-1.5,2.5) F8(-0.5,2.5) F9(0.5,2.5) F10(1.5,2.5) F11(2.5,2.5) F12(3.5,2.5) F13(4.5,2.5) F14(5.5,2.5) F15(6.5,2.5) F16(7.5,2.5) G1(-7.5,1.5) G2(-6.5,1.5) G3(-5.5,1.5) G4(-4.5,1.5) G5(-3.5,1.5) G6(-2.5,1.5) G7(-1.5,1.5) G8(-0.5,1.5) G9(0.5,1.5) G10(1.5,1.5) G11(2.5,1.5) G12(3.5,1.5) G13(4.5,1.5) G14(5.5,1.5) G15(6.5,1.5) G16(7.5,1.5) H1(-7.5,0.5) H2(-6.5,0.5) H3(-5.5,0.5) H4(-4.5,0.5) H5(-3.5,0.5) H6(-2.5,0.5) H7(-1.5,0.5) H8(-0.5,0.5) H9(0.5,0.5) H10(1.5,0.5) H11(2.5,0.5) H12(3.5,0.5) H13(4.5,0.5) H14(5.5,0.5) H15(6.5,0.5) H16(7.5,0.5) J1(-7.5,-0.5) J2(-6.5,-0.5) J3(-5.5,-0.5) J4(-4.5,-0.5) J5(-3.5,-0.5) J6(-2.5,-0.5) J7(-1.5,-0.5) J8(-0.5,-0.5) J9(0.5,-0.5) J10(1.5,-0.5) J11(2.5,-0.5) J12(3.5,-0.5) J13(4.5,-0.5) J14(5.5,-0.5) J15(6.5,-0.5) J16(7.5,-0.5) K1(-7.5,-1.5) K2(-6.5,-1.5) K3(-5.5,-1.5) K4(-4.5,-1.5) K5(-3.5,-1.5) K6(-2.5,-1.5) K7(-1.5,-1.5) K8(-0.5,-1.5) K9(0.5,-1.5) K10(1.5,-1.5) K11(2.5,-1.5) K12(3.5,-1.5) K13(4.5,-1.5) K14(5.5,-1.5) K15(6.5,-1.5) K16(7.5,-1.5) L1(-7.5,-2.5) L2(-6.5,-2.5) L3(-5.5,-2.5) L4(-4.5,-2.5) L5(-3.5,-2.5) L6(-2.5,-2.5) L7(-1.5,-2.5) L8(-0.5,-2.5) L9(0.5,-2.5) L10(1.5,-2.5) L11(2.5,-2.5) L12(3.5,-2.5) L13(4.5,-2.5) L14(5.5,-2.5) L15(6.5,-2.5) L16(7.5,-2.5) M1(-7.5,-3.5) M2(-6.5,-3.5) M3(-5.5,-3.5) M4(-4.5,-3.5) M5(-3.5,-3.5) M6(-2.5,-3.5) M7(-1.5,-3.5) M8(-0.5,-3.5) M9(0.5,-3.5) M10(1.5,-3.5) M11(2.5,-3.5) M12(3.5,-3.5) M13(4.5,-3.5) M14(5.5,-3.5) M15(6.5,-3.5) M16(7.5,-3.5) N1(-7.5,-4.5) N2(-6.5,-4.5) N3(-5.5,-4.5) N4(-4.5,-4.5) N5(-3.5,-4.5) N6(-2.5,-4.5) N7(-1.5,-4.5) N8(-0.5,-4.5) N9(0.5,-4.5) N10(1.5,-4.5) N11(2.5,-4.5) N12(3.5,-4.5) N13(4.5,-4.5) N14(5.5,-4.5) N15(6.5,-4.5) N16(7.5,-4.5) P1(-7.5,-5.5) P2(-6.5,-5.5) P3(-5.5,-5.5) P4(-4.5,-5.5) P5(-3.5,-5.5) P6(-2.5,-5.5) P7(-1.5,-5.5) P8(-0.5,-5.5) P9(0.5,-5.5) P10(1.5,-5.5) P11(2.5,-5.5) P12(3.5,-5.5) P13(4.5,-5.5) P14(5.5,-5.5) P15(6.5,-5.5) P16(7.5,-5.5) R1(-7.5,-6.5) R2(-6.5,-6.5) R3(-5.5,-6.5) R4(-4.5,-6.5) R5(-3.5,-6.5) R6(-2.5,-6.5) R7(-1.5,-6.5) R8(-0.5,-6.5) R9(0.5,-6.5) R10(1.5,-6.5) R11(2.5,-6.5) R12(3.5,-6.5) R13(4.5,-6.5) R14(5.5,-6.5) R15(6.5,-6.5) R16(7.5,-6.5) T1(-7.5,-7.5) T2(-6.5,-7.5) T3(-5.5,-7.5) T4(-4.5,-7.5) T5(-3.5,-7.5) T6(-2.5,-7.5) T7(-1.5,-7.5) T8(-0.5,-7.5) T9(0.5,-7.5) T10(1.5,-7.5) T11(2.5,-7.5) T12(3.5,-7.5) T13(4.5,-7.5) T14(5.5,-7.5) T15(6.5,-7.5) T16(7.5,-7.5)
FPC-SMD_18P-P0.50_FPC-05F-18PH20
  rect 0.3x1.25 smd: 1(-4.25,1.288) 2(-3.75,1.288) 3(-3.25,1.288) 4(-2.75,1.288) 5(-2.25,1.288) 6(-1.75,1.288) 7(-1.25,1.288) 8(-0.75,1.288) 9(-0.25,1.288) 10(0.25,1.288) 11(0.75,1.288) 12(1.25,1.288) 13(1.75,1.288) 14(2.25,1.288) 15(2.75,1.288) 16(3.25,1.288) 17(3.75,1.288) 18(4.25,1.288)
  rect 2x2.5 smd: 19(-5.94,-1.288) 20(5.94,-1.252)
hdmi-smd_hdmi-101s
  rect 0.2x0.84 smd: 1(1.8,2.385) 3(1.4,2.385) 5(1,2.385) 7(0.6,2.385) 9(0.2,2.385) 11(-0.2,2.385) 13(-0.6,2.385) 15(-1,2.385) 17(-1.4,2.385) 19(-1.8,2.385)
  rect 0.2x1 smd: 2(1.6,1.165) 4(1.2,1.165) 6(0.8,1.165) 8(0.4,1.165) 10(0,1.165) 12(-0.4,1.165) 14(-0.8,1.165) 16(-1.2,1.165) 18(-1.6,1.165)
  oval 1.5x2.55 hole 0.7x1.7: 20(-3.1,0.975) 20(-3.1,-2.385) 20(3.1,0.975) 20(3.1,-2.385)
HDR-TH_40P-P2.54-V-M-R2-C20-S2.54
  rect 1.575x1.8 hole 1.1: 1(-24.13,-1.27)
  round 1.8 hole 1.1: 2(-24.13,1.27) 3(-21.59,-1.27) 4(-21.59,1.27) 5(-19.05,-1.27) 6(-19.05,1.27) 7(-16.51,-1.27) 8(-16.51,1.27) 9(-13.97,-1.27) 10(-13.97,1.27) 11(-11.43,-1.27) 12(-11.43,1.27) 13(-8.89,-1.27) 14(-8.89,1.27) 15(-6.35,-1.27) 16(-6.35,1.27) 17(-3.81,-1.27) 18(-3.81,1.27) 19(-1.27,-1.27) 20(-1.27,1.27) 21(1.27,-1.27) 22(1.27,1.27) 23(3.81,-1.27) 24(3.81,1.27) 25(6.35,-1.27) 26(6.35,1.27) 27(8.89,-1.27) 28(8.89,1.27) 29(11.43,-1.27) 30(11.43,1.27) 31(13.97,-1.27) 32(13.97,1.27) 33(16.51,-1.27) 34(16.51,1.27) 35(19.05,-1.27) 36(19.05,1.27) 37(21.59,-1.27) 38(21.59,1.27) 39(24.13,-1.27) 40(24.13,1.27)
IND-SMD_L4.4-W4.2
  rect 1.4x2.12 smd: 1(2.028,0) 2(-2.028,0)
KEY-SMD_B3U-1000PM
  rect 0.8x1.7 smd: 1(-1.7,0) 2(1.7,0)
L0402
  rect 0.79x0.54 smd: 1(-0.545,0) 2(0.545,0)
L0603
  rect 0.8x0.864 smd: 1(-0.7,0) 2(0.7,0)
LED0603-RD
  rect 0.8x0.8 smd: 1(-0.799,0) 2(0.799,0)
LED-SEG-SMD_SLS0281FR1A1GD
  rect 1x2 smd: 1(-3,-6) 2(-1.5,-6) 3(0,-6) 4(1.5,-6) 5(3,-6) 6(3,6) 7(1.5,6) 8(0,6) 9(-1.5,6) 10(-3,6)
LED-SMD_4P-L1.6-W1.6-TL-FD
  rect 0.6x0.7 smd: 1(-0.7,0.5) 2(0.7,0.5) 3(-0.7,-0.5) 4(0.7,-0.5)
LQFP-48_L7.0-W7.0-P0.50-LS9.0-BL
  oval 0.27x1.5 smd: 1(-2.75,-4.25) 2(-2.25,-4.25) 3(-1.75,-4.25) 4(-1.25,-4.25) 5(-0.75,-4.25) 6(-0.25,-4.25) 7(0.25,-4.25) 8(0.75,-4.25) 9(1.25,-4.25) 10(1.75,-4.25) 11(2.25,-4.25) 12(2.75,-4.25) 25(2.75,4.25) 26(2.25,4.25) 27(1.75,4.25) 28(1.25,4.25) 29(0.75,4.25) 30(0.25,4.25) 31(-0.25,4.25) 32(-0.75,4.25) 33(-1.25,4.25) 34(-1.75,4.25) 35(-2.25,4.25) 36(-2.75,4.25)
  oval 1.5x0.27 smd: 13(4.25,-2.75) 14(4.25,-2.25) 15(4.25,-1.75) 16(4.25,-1.25) 17(4.25,-0.75) 18(4.25,-0.25) 19(4.25,0.25) 20(4.25,0.75) 21(4.25,1.25) 22(4.25,1.75) 23(4.25,2.25) 24(4.25,2.75) 37(-4.25,2.75) 38(-4.25,2.25) 39(-4.25,1.75) 40(-4.25,1.25) 41(-4.25,0.75) 42(-4.25,0.25) 43(-4.25,-0.25) 44(-4.25,-0.75) 45(-4.25,-1.25) 46(-4.25,-1.75) 47(-4.25,-2.25) 48(-4.25,-2.75)
OSC-SMD_4P-L3.2-W2.5-BL
  rect 1.4x1.2 smd: 1(-1.1,-0.875) 2(1.1,-0.875) 3(1.1,0.875) 4(-1.1,0.875)
R0402
  rect 0.566x0.54 smd: 1(-0.433,0) 2(0.433,0)
R0603
  rect 0.806x0.864 smd: 1(-0.753,0) 2(0.753,0)
RES-ARRAY-SMD_0402-8P-L2.0-W1.0-BL
  rect 0.3x0.505 smd: 1(-0.75,0.427) 2(-0.25,0.427) 3(0.25,0.427) 4(0.75,0.427) 5(0.75,-0.427) 6(0.25,-0.427) 7(-0.25,-0.427) 8(-0.75,-0.427)
SOD-323_L1.8-W1.3-LS2.5-RD
  rect 1x0.75 smd: 1(-1.173,0) 2(1.173,0)
SOP-8_L5.3-W5.3-P1.27-LS8.0-BL
  oval 0.609x2.204 smd: 1(-1.905,-3.542) 2(-0.635,-3.542) 3(0.635,-3.542) 4(1.905,-3.542) 5(1.905,3.542) 6(0.635,3.542) 7(-0.635,3.542) 8(-1.905,3.542)
SOT-23-3_L3.0-W1.7-P0.95-LS2.9-BR
  rect 1.038x0.532 smd: 1(1.101,-0.95) 2(1.101,0.95) 3(-1.101,0)
SW-SMD_4P-L4.2-W3.3-P2.15-LS5.1
  rect 1.3x0.7 smd: 1(-2.25,1.075) 2(2.25,1.075) 3(-2.25,-1.075) 4(2.25,-1.075)
Test-Point-0.5mm
  round 1 smd: 1(0,0)
TF-SMD_TF-PUSH
  rect 0.7x1.6 smd: 1(2.25,5.3) 2(1.15,5.3) 3(0.05,5.3) 4(-1.05,5.3) 5(-2.15,5.3) 6(-3.25,5.3) 7(-4.35,5.3) 8(-5.45,5.3) CD(-6.55,5.3)
  rect 1.2x1.5 smd: 10(-7.75,4.3)
  rect 1.2x2.2 smd: 11(-7.75,-5.3) 12(7.75,-5.3)
  rect 1.6x1.5 smd: 13(6.85,4.3)
TSOT-23-6_L2.9-W1.6-P0.95-LS2.8-BR
  rect 0.8x0.532 smd: 1(1.2,-0.95) 2(1.2,0) 3(1.2,0.95) 4(-1.2,0.95) 5(-1.2,0) 6(-1.2,-0.95)
USB-C-SMD_TYPE-C-6PIN-2MD-073
  rect 0.6x1.1 smd: 1(-3.2,2.375) 2(-2.4,2.375) 11(2.4,2.375) 12(3.2,2.375)
  rect 0.3x1.1 smd: 3(-1.75,2.375) 4(-1.25,2.375) 5(-0.75,2.375) 6(-0.25,2.375) 7(0.25,2.375) 8(0.75,2.375) 9(1.25,2.375) 10(1.75,2.375)
  oval 1.2x2 hole 0.6x1.5: 13(-4.325,1.825) 14(4.325,1.825)
  oval 1.2x1.8 hole 0.6x1.2: 13(-4.325,-2.375) 14(4.325,-2.375)
WSON-10_L3.0-W3.0-P0.50-BL-EP
  rect 0.25x0.6 smd: 1(-1.001,-1.4) 2(-0.5,-1.4) 3(0,-1.4) 4(0.5,-1.4) 5(1.001,-1.4) 6(1.001,1.4) 7(0.5,1.4) 8(0,1.4) 9(-0.5,1.4) 10(-1.001,1.4)
  custom 3.4x1.65 smd: 11(0,0)

## Nets
As in the schematic.

Pads without a net: CARD2 1 8 CD; CN1 7 8; FPC1 1 2 3 4 19 20; H6 12; U1 3 4; U7 A2 A8 A10 B4 B5 B6 C2 C5 C7 D1 D2 D7 D9 E3 E7 E8 E9 E11 F1 F2 G4 G6 H1 H2 H6 J4 J6 K1 K2 L3 L4 L5 M1 N1 N3 P1 P2 R5 T2 T3 T4 T5; U29 J1 J9 L1 L9 M7 T7; USB2 3 9; USB3 2

## Via types
v1: diameter 0.457, hole 0.305, Top Layer to Bottom Layer, 653 vias

## Routing (per net, layer and track width the routed paths; a pad name or vN(x,y) marks a point on that pad's centre or on a via; arc(x,y) is an arc through that point)
+1.0V: length 69.8
  Top Layer w0.381: 20.21,42.13 v1(19.76,42.57) ; 26.21,36.13 v1(25.71,36.63) ; v1(35.65,42.61) 35.21,42.17 35.21,42.13 ; 35.21,27.13 v1(35.71,26.63) ; L18.2 23.45,10.19 23.45,11.99 23.52,12.06 ; 20.21,27.12 20.21,27.01 v1(20.73,26.5) ; 29.21,33.13 v1(29.71,32.63)
  PWR w0.381: v1(35.71,26.63) 35.81,26.53 36.21,26.53 36.48,26.79 36.48,41.78 v1(35.65,42.61) ; v1(19.76,42.57) 19.56,42.37 18.12,42.37 17.78,42.03 17.78,41.08 19.13,39.74 21.21,39.74 21.46,39.49 21.46,39.08 23.16,37.38 24.96,37.38 v1(25.71,36.63) 25.84,36.63 27.32,35.15 27.86,35.15 28.52,34.49 28.52,33.82 v1(29.71,32.63)
  Bottom Layer w0.381: C148.2 20.71,26.44 C159.2 ; 23.61,33.76 24.16,34.31 24.16,35.16 25.68,36.69 ; 28.7,33.65 29.71,32.63 v1(29.71,32.63) ; C158.2 35.36,42.83 35.58,42.61 ; C154.2 35.71,25.9 v1(35.71,26.63) ; C156.2 20.72,43.75 C149.2 19.76,43.69 v1(19.76,42.57) ; v1(25.71,36.63) 26.09,37 L12.1 27.51,37.3 28.24,38.02 28.24,40.34 28.08,40.5 28.08,41.21 28.2,41.34 28.2,41.35 28.94,42.09 30.51,42.09 30.82,41.78 33.59,41.78 34.42,42.61 35.58,42.61 ; 35.58,42.61 35.58,42.6 ; 35.58,42.61 v1(35.65,42.61) ; R163.2 22.9,3.73
  vias: v1(21.99,4.91) v1(22.5,4.91) v1(22.61,10.63) v1(22.59,9.97) v1(22.59,9.36)
+1.5V: length 46.6
  Top Layer w0.254: U29.N9 9.89,38.55 v1(9.45,38.99) ; U29.G7 v1(11.1,33.35) ; U29.H9 v1(9.5,34.15) ; U29.F1 16.47,32.95 v1(16.85,32.57) ; v1(15.9,29.34) U29.B2 ; v1(15.9,29.34) U29.A1 v1(15.9,29.34) ; v1(16.9,40.56) 16.49,40.15 U29.R1 ; U29.D2 15.51,31.35 v1(15.93,30.92) ; U29.N1 16.38,38.55 v1(16.74,38.9) ; 15.5,34.55 15.5,34.53 v1(15.88,34.15) ; U29.K8 v1(10.3,36.55) ; v1(15.91,36.55) 15.51,36.15 U29.K2 ; U29.A8 v1(10.3,28.55)
  Top Layer w0.381: L17.2 18.61,10.18 18.61,12.18 18.62,12.19 ; U29.E9 9.53,31.77 v1(9.53,31.76) ; v1(22.76,30.87) 23.01,31.13 23.21,31.13 ; U29.C9 v1(9.5,30.15) ; U29.D9 9.54,30.99 v1(9.54,30.97) ; 26.21,35.13 25.97,35.13 v1(25.66,35.44) ; 23.21,38.13 v1(22.71,38.63) ; 24.21,39.13 v1(23.71,39.63) ; v1(12.71,14.54) 12.73,14.56 L8.2 ; U29.R9 9.46,40.58 v1(9.4,40.58) ; v1(15.93,30.92) 16.3,30.56 U29.C1 ; U7.J7 U7.H7
  Bottom Layer w0.381: v1(25.66,35.44) 25.66,35.27 25.29,34.9 ; C142.2 16.95,28.29 v1(15.9,29.34) ; 7.41,33.4 7.41,33.47 7.62,33.68 8.08,33.68 C27.2 8.75,33.69 C33.2 9.06,33.71 v1(9.5,34.15) ; C32.2 10.73,26.48 C35.2 10.73,27.14 C140.2 10.73,28.11 v1(10.3,28.55) ; C31.2 9.13,30.51 v1(9.5,30.15) ; C31.2 C34.2 ; C31.2 8.74,30.5 C147.2 ; R166.2 C184.2 ; v1(16.74,38.9) 17.28,38.9 C97.2 18.26,38.72 18.27,38.71 ; C141.2 18.23,32.27 C100.2 17.16,32.57 v1(16.85,32.57) ; v1(15.93,30.92) 16.71,30.15 17.46,30.15 C102.2 18.24,30.12 18.25,30.11 ; v1(16.9,40.56) 17.17,40.56 C98.2 C101.2 ; C147.2 7.51,30.5 7.49,30.53 ; C147.2 8.07,29.52 C105.2 7.49,29.5 7.46,29.54 ; C103.2 C99.2 17.16,34.42 16.91,34.67 16.4,34.67 v1(15.88,34.15)
  Bottom Layer w0.762: C101.2 19.82,40.85 22.06,38.61 22.7,38.61 v1(22.71,38.63)
  vias: v1(17.05,4.95) v1(17.17,10.64) v1(17.16,9.99) v1(17.16,9.38) v1(17.59,4.93) v1(17.73,10.65) v1(17.71,9.99) v1(17.71,9.38)
+3.3V: length 189.5
  Top Layer w0.254: v1(25.31,60.72) 25.34,60.69 U1.36 ; 33.54,58.28 33.06,58.28 U1.24 32.16,57.75 v1(31.34,57.75) ; FPC1.10 29.5,61.93 29.66,61.77 v1(30.8,61.77) ; v1(25.98,49.38) 25.94,49.34 25.34,49.94 U1.1 25.34,51.83 25.11,52.07 U1.48
  Top Layer w0.381: 29.2,34.13 29.2,34.1 28.21,33.12 U7.K9 ; 29.2,34.13 29.2,35.11 U7.H10 29.2,35.21 28.66,35.75 v1(27.73,35.75) ; 29.2,34.13 29.2,34.12 U7.J10 ; 21.71,18.53 22.03,18.21 22.03,18.16 22.03,18.16 22.03,18.48 ; 21.71,18.53 16.23,18.53 ; 21.71,18.53 22.03,18.85 ; 21.71,18.53 21.98,18.53 22.03,18.48 ; 22.03,18.85 22.03,18.48 ; 22.03,18.85 v1(22.03,19.21) 22.1,19.14 23.57,19.14 23.84,19.41 23.84,19.51 ; v1(23.01,59.66) 23.67,59.66 SW5.2 ; C164.2 37.31,24.61 C165.2 37.27,24.57 C163.2 C161.2 37.27,21.55 C162.2 37.27,20.49 C178.2 37.3,20.43 C179.2 37.3,18.29 37.73,18.72 39.82,18.72 40.26,18.27 40.26,15.99 41.38,14.87 H6.38 ; 15.69,18.53 15.28,18.53 15,18.81 15,25.26 15.33,25.59 17.06,25.59 ; 15.69,18.53 16.23,18.53 ; 15.69,18.53 15.96,18.26 ; 15.73,13.92 16.25,13.92 ; 15.73,13.92 16.25,13.4 ; 15.73,13.92 16.25,14.43 ; 15.73,13.92 11.94,13.92 ; 16.25,13.92 16.25,13.4 ; 16.25,13.92 16.25,14.43 ; U7.K9 28.2,33 v1(28.58,32.63) ; U7.K9 U7.K8 ; v1(33.84,19.85) 33.84,19.84 32.6,19.84 ; 27.42,19.84 32.06,19.84 ; 27.42,19.84 26.96,19.84 ; 27.42,19.84 27.19,19.61 ; 32.06,19.84 32.6,19.84 ; 32.06,19.84 32.33,19.57 ; 17.88,25.59 17.88,25.59 17.06,25.59 ; 17.88,25.59 20.14,25.59 ; 17.88,25.59 17.64,25.59 17.34,25.29 ; 32.6,19.84 32.33,19.57 ; v1(27.73,35.75) 27.35,36.13 27.21,36.13 ; v1(27.73,35.75) 28.09,36.12 U7.G9 ; 32.21,31.13 32.3,31.13 v1(32.63,30.8) ; v1(22.11,66.16) 22.11,66.16 R2.2 ; 24.17,19.84 26.96,19.84 ; 24.17,19.84 23.84,19.51 ; 24.17,19.84 23.84,19.84 ; 24.17,19.84 23.84,20.17 ; 26.96,19.84 27.19,19.61 ; 23.84,19.51 23.84,19.84 ; 23.84,19.84 23.84,20.17 ; 16.23,18.53 15.96,18.26 ; 20.51,25.22 20.87,25.59 ; 20.51,25.22 20.14,25.59 ; 20.51,25.22 20.51,23.21 LED3.2 ; 20.51,25.22 20.51,25.57 20.53,25.59 ; 20.87,25.59 20.53,25.59 ; 20.87,25.59 22.27,25.59 22.66,25.19 LED2.2 ; 31.21,30.13 31.21,29.94 v1(31.7,29.45) ; 15.96,18.26 v1(15.96,17.19) 15.96,16.54 v1(15.94,16.53) 16.25,16.22 16.25,14.43 ; 20.14,25.59 20.53,25.59 ; 9.89,13.92 9.59,13.62 ; 9.89,13.92 11,13.92 ; 9.89,13.92 9.29,13.92 ; 9.59,13.62 9.29,13.92 ; 9.59,13.62 R154.2 ; 27.19,19.61 27.19,18.2 27.16,18.16 ; 16.25,13.4 R155.2 ; LED1.2 17.34,22.82 17.34,25.29 ; 17.06,25.59 17.34,25.31 17.34,25.29 ; v1(16.05,55.61) 16.05,57.78 LED6.8 ; 23.84,20.17 23.84,20.59 L16.1 ; U1.9 29.34,49.45 v1(29.35,49.45) 30.92,47.88 R136.1 31.68,47.49 R137.1 32.45,47.5 R138.1 ; 32.33,19.57 32.33,18.13 32.35,18.11 ; 11.49,13.92 11.94,13.92 ; 11.49,13.92 11.49,14.37 ; 11.49,13.92 11,13.92 ; 11.94,13.92 11.49,14.37 ; 32.21,38.13 32.35,38.13 32.74,38.52 v1(32.74,38.57) ; LED6.3 15.84,44.47 15.51,44.14 9.35,44.14 8.63,44.85 8.63,62.17 8.86,62.39 v1(9.39,62.39) ; 9.29,13.92 8.09,13.92 7.14,14.87 H5.38 ; 11.49,14.37 11.49,14.4 ; 24.21,30.13 v1(23.71,29.63) ; 11,13.92 11.49,14.4 ; 11.49,14.4 11.49,15.36 L9.2 ; 31.21,39.13 v1(31.71,39.63)
  Bottom Layer w0.381: v1(30.8,61.77) 31.68,61.77 31.91,62 31.91,62.64 R7.2 ; v1(25.98,49.38) 26.01,49.41 26.01,51.01 25.7,51.32 23.79,51.32 ; C124.2 28.45,36.22 28.19,36.22 v1(27.73,35.75) ; C166.2 8.51,57.98 8.72,57.78 15.78,57.78 16.09,57.46 16.09,55.64 v1(16.05,55.61) ; L2.2 36.97,17.14 38.01,16.1 40.34,16.1 H6.38 ; L2.2 36.36,17.5 34.01,19.85 v1(33.84,19.85) ; L2.2 36.45,17.05 C114.2 36.45,12.57 R37.2 C177.2 ; R30.1 18,13.73 16.96,13.73 16.75,13.95 C57.1 16.76,14.86 U30.8 ; R31.2 22.03,20.22 v1(22.03,19.21) ; v1(29.35,49.45) 29.7,49.8 C169.2
  vias: v1(8.66,63.25) v1(8.65,62.39) v1(9.39,63.25)
+5V_IN: length 123.3
  Top Layer w0.381: USB2.2 29.51,8.61 C118.2 29.3,8.82 v1(29.3,9.48) 28.92,9.86 v1(28.92,9.92) 28.46,10.38 ; v1(21.07,2.23) 20.24,2.23 U31.5 ; D8.2 36.01,9.07 C117.2 34.31,8.19 USB2.11 ; v1(26.26,2.23) 25.25,2.23 U32.5
  SIN2 w0.381: v1(33.98,65.85) 33.98,65 33.33,64.35 v1(11.68,64.35)
  Bottom Layer w0.254: 42.76,61.7 42.65,61.81 37.48,61.81 36.54,62.75 36.54,65.53 36.21,65.86 33.99,65.86 v1(33.98,65.85)
  Bottom Layer w0.381: v1(28.42,12.31) 29.55,12.31 C180.2 30.7,12.22 C174.2 31.73,12.22 U2.5 ; v1(21.07,2.23) 21.07,2.72 C181.2 20.69,3.09 C187.2 ; v1(21.07,2.23) 20.45,2.23 R157.2 ; v1(21.07,2.23) v1(21.07,1.67) ; R36.2 28.46,11.2 v1(28.46,10.38) ; C194.2 25.9,3.08 C188.2 26.26,2.72 v1(26.26,2.23) 26.18,2.16 25.46,2.16 ; D4.2 14.19,10.02 15.98,11.81 v1(28.42,11.81) ; C171.2 34,63.81 34,65.83 v1(33.98,65.85) ; 42.76,61.7 43.37,61.08 43.37,12.48 42.99,12.1 41.8,12.1 H6.40
  vias: v1(10.93,63.43) v1(10.92,62.47) v1(10.96,64.35) v1(11.7,63.43) v1(11.7,62.49) v1(26.26,1.67) v1(30.88,5.7) v1(31.42,5.7) v1(31.91,5.7) v1(32.44,5.7) v1(32.48,12.21) v1(32.99,5.7) v1(37.18,9.05) v1(38.15,9.05) v1(39.14,9.06) v1(40.16,9.07) v1(41.17,10.54) v1(41.16,9.08) v1(41.99,10.54) v1(42.02,9.08)
GND: length 198.3
  Top Layer w0.178: v1(13.73,4.96) 13.35,5.34 USB3.4 ; v1(10.58,4.97) 10.95,5.33 USB3.16 ; D9.8 14.52,9.47 v1(14.52,8.86) ; USB3.13 11.56,7.44 11.56,8.66 11.62,8.73 11.62,8.98 11.42,9.18 D10.8 ; USB3.10 12.15,5.2 ; v1(12.74,8.44) 12.75,8.43 USB3.7
  Top Layer w0.254: U29.G9 v1(9.5,33.35) ; U29.G8 v1(10.3,33.35) ; v1(16.81,39.72) 16.67,39.72 U29.P1 ; v1(15.91,34.94) 15.51,35.35 U29.J2 ; v1(25.45,62.87) 25.5,62.92 FPC1.18 ; U23.4 12.08,19.42 U23.11 ; v1(21.83,28.91) 22.03,29.12 22.04,29.12 ; U29.A9 v1(9.5,28.55) ; 15.55,32.13 16.25,32.13 16.26,32.15 ; U29.M1 16.43,37.75 v1(16.81,38.12) ; U29.E8 v1(10.3,31.75) ; v1(16.79,29.34) 16.39,29.75 U29.B1 ; U1.35 25.84,60.72 v1(25.95,60.83) ; v1(31.19,57.15) 31.27,57.07 U1.23 33.41,57.07 33.54,57.19 ; U29.J8 10.69,35.35 v1(10.29,34.95) ; U29.B9 v1(9.5,29.35) ; U29.D8 v1(10.3,30.95) ; U1.47 22.8,52.57 v1(22.61,52.38) ; U23.8 11.22,18.92 ; v1(16.77,33.35) 16.38,33.75 16.3,33.75 ; v1(20.73,27.77) 21.09,28.13 21.21,28.13 ; U29.F9 v1(9.5,32.55) ; U29.B3 v1(15.1,29.35)
  Top Layer w0.381: v1(16.78,41.48) 16.78,41.43 U29.T1 ; D8.1 35.81,10.47 C117.1 34.99,10.27 R103.2 ; v1(29.47,10.44) 29.93,10.44 R104.2 30.73,10.31 E1.1 ; 30.21,37.13 30.29,37.13 v1(30.87,37.7) 31.71,38.54 v1(31.71,38.63) 31.75,38.63 32.25,39.13 ; C75.1 13.01,16.43 11.18,16.43 11.18,17.77 11.57,18.17 ; 33.21,29.07 v1(33.68,28.6) 33.72,28.6 U7.R15 ; 33.21,29.07 33.21,29.13 ; 33.21,29.07 31.7,30.58 v1(31.7,30.72) 31.62,30.72 v1(30.71,31.63) 30.21,32.13 ; v1(18.69,2.11) 18.5,2.31 17.77,2.31 ; R9.2 34.01,47.5 R134.2 R133.2 35.2,47.89 v1(35.2,48.1) ; U29.P9 9.47,39.77 v1(9.1,39.77) ; v1(20.71,41.49) 21.07,41.13 21.21,41.13 ; 12.02,21.94 C136.1 12.02,22.61 12.01,22.63 12,22.63 C88.2 C89.2 ; 12.02,21.94 C89.2 ; 12.02,21.94 12.02,21.94 C134.1 12.01,21.24 C77.2 11.08,21.25 C89.2 ; v1(25.16,46.75) v1(25.16,45.79) v1(25.16,45) v1(25.16,44.27) 25.16,44.12 25.59,43.68 v1(26.16,43.68) v1(26.94,43.68) v1(27.77,43.68) v1(28.54,43.68) v1(29.32,43.68) 29.71,43.68 30.07,44.04 v1(30.07,44.24) v1(30.07,44.95) ; v1(25.16,46.75) v1(25.16,47.61) C1.2 26.56,49 v1(26.56,49.02) ; v1(25.16,46.75) 25.24,46.67 X1.2 ; 33.54,57.19 34.07,57.19 34.28,57.4 NC1.1 ; 22.21,29.13 22.2,29.13 ; 22.21,29.13 v1(22.71,29.63) 23.71,30.63 v1(23.71,30.74) 24.1,31.13 ; 22.21,29.13 22.2,29.12 ; 22.2,40.12 22.69,39.63 v1(22.71,39.63) v1(23.71,38.63) 23.71,38.6 25.19,37.13 25.21,37.13 ; 11.42,10.49 D10.8 ; U7.H8 27.79,34.53 27.79,34.7 U7.H9 ; 32.25,39.13 v1(32.69,39.57) 33.68,40.56 ; 32.25,39.13 32.21,39.13 ; 33.68,40.56 34.23,41.11 ; 33.68,40.56 v1(33.68,40.57) ; v1(30.07,44.95) 30.04,44.92 X1.4 ; v1(30.07,44.95) v1(30.07,45.81) v1(30.07,46.74) v1(30.07,47.61) C2.1 29.48,48.18 28.65,49.01 v1(28.65,49.13) ; USB2.14 35.69,7.43 USB2.12 ; v1(23.31,21.35) v1(23.31,22.1) v1(23.31,22.98) v1(23.31,23.83) v1(23.31,24.66) 23.31,24.76 v1(23.72,25.17) 23.75,25.2 v1(24.66,25.2) 24.67,25.2 v1(25.09,25.62) ; U29.T9 9.85,40.95 9.68,41.12 9.67,41.12 v1(9.38,41.4) ; D9.3 D9.8 ; v1(27.28,25.43) 27.54,25.43 v1(28.18,24.79) 28.18,24.04 v1(28.19,24.03) 28.19,23.15 v1(28.2,23.15) 28.23,23.12 28.23,22.25 v1(28.22,22.24) 28.22,21.41 v1(28.22,21.4) 28.2,21.37 28.2,21.18 C56.1 27.42,20.94 27.42,21.63 X3.2 ; 20.01,11.03 20.13,11.15 20.13,12.19 ; U29.M9 v1(9.5,38.15) ; U32.2 23.52,2.31 v1(23.76,2.07) ; v1(23.21,63.69) 23.73,63.17 SW4.1 ; 24.21,31.13 24.1,31.13 ; 24.1,31.13 25.09,32.12 25.2,32.12 ; 19.42,63.23 19.51,63.31 U20.1 ; 28.21,34.13 28.13,34.13 v1(27.79,34.46) 27.55,34.46 U7.J8 ; v1(18.13,59.78) 18.13,59.81 R4.1 ; C164.1 36.22,24.61 35.87,24.27 C163.1 C161.1 35.87,22.64 C162.1 35.87,20.49 C178.1 35.86,19.47 C179.1 35.98,19.23 SW1.4 35.91,17.91 35.91,17.13 36.16,16.89 C160.1 ; C118.1 28.28,7.87 USB2.1 28.16,6.88 USB2.13 ; 25,12.09 25,11.12 24.85,10.97 ; 11.22,18.92 U23.11 ; v1(17.36,30.99) 16.65,30.99 U29.D1 U29.E1
  Bottom Layer w0.254: C98.1 17.43,39.72 v1(16.81,39.72)
  Bottom Layer w0.381: 26.54,34.59 26.08,34.13 26.06,34.13 25.66,33.73 25.54,33.73 ; 26.54,34.59 26.54,34.45 27.19,33.8 ; 26.54,34.59 27.05,35.09 27.28,35.09 ; v1(16.77,33.35) 17.45,33.35 C99.1 C103.1 ; C188.1 25.8,4.48 C194.1 ; C98.1 C101.1 ; C156.1 20.72,44.84 ; 20.72,44.84 R109.1 ; 20.72,44.84 20.41,45.15 C149.1 ; v1(9.5,38.15) 8.94,38.71 R132.1 ; 32.65,29.63 v1(33.68,28.6) 34.26,28.02 C153.1 34.26,25.83 C154.1 ; 32.65,29.63 33.07,29.63 33.52,30.09 R135.2 ; 32.65,29.63 C115.1 ; R158.1 19.43,2.11 v1(18.69,2.11) 18.69,2.1 R165.1 17.9,1.36 17.88,1.34 ; 27.19,33.8 27.74,33.25 ; 27.19,33.8 27.79,34.41 v1(27.79,34.46) 28.1,34.46 C124.1 29.44,34.97 C128.1 30.09,34.55 C127.1 ; 24.46,31.56 24.46,31.49 v1(23.71,30.74) ; D11.8 15.48,52.53 v1(15.48,52.18) ; 8.31,60.39 8.5,60.39 v1(9.17,59.72) 8.52,59.07 8.3,59.07 ; R162.1 24.53,2.07 v1(23.76,2.07) 23.72,2.03 R164.1 ; C85.2 10.95,50.02 C82.1 12.19,50.03 C84.2 13.35,50.02 C135.1 C83.1 C139.2 17.03,50 C137.2 18.22,50 C23.2 19.42,49.98 C138.2 ; v1(35.28,64.55) 35.28,64.55 C171.1 ; 26.67,35.7 27.28,35.09 ; 27.28,35.09 27.79,34.58 ; v1(16.81,38.12) 17.31,37.63 C97.1 18.26,37.63 C96.1 18.33,37.55 18.33,36.65 ; v1(17.36,30.99) 17.47,31.11 C100.1 18.23,31.17 C141.1 ; 34.59,41.61 34.59,41.48 v1(33.68,40.57) ; 24.3,36.91 23.71,37.49 v1(23.71,38.63) ; C142.1 18.25,28.35 18.25,29.02 18.24,29.03 C102.1 17.17,29.34 v1(16.79,29.34) ; R76.1 14.61,18.98 C119.1 ; D11.3 15.46,52.57 ; C34.1 9.36,28.41 v1(9.5,28.55) 9.64,28.4 C140.1 ; 20.69,4.6 20.58,4.49 C187.1 ; U30.4 21.95,23.55 v1(21.96,23.55) ; v1(22.71,39.63) 20.85,41.49 v1(20.71,41.49) ; v1(35.54,14.74) 35.54,13.55 C114.1 ; C189.1 22.93,2.03 ; C175.1 R156.1 29.98,10.44 v1(29.47,10.44) ; C69.1 12.27,10.14 C68.2 ; C33.1 8.77,31.62 C31.1 8.74,31.59 C147.1 8.09,31.61 C27.1 8.75,32.6 C33.1
  vias: v1(0.59,64.85) v1(0.59,62.31) v1(0.59,59.77) v1(0.59,57.23) v1(0.59,54.69) v1(0.59,52.15) v1(0.59,49.61) v1(0.59,47.07) v1(0.59,44.53) v1(0.59,41.99) v1(0.59,39.45) v1(0.59,36.91) v1(0.59,34.37) v1(0.59,31.83) v1(0.59,29.29) v1(0.59,26.75) v1(0.59,24.21) v1(0.59,21.67) v1(0.59,19.13) v1(0.59,16.59) v1(0.59,14.05) v1(0.59,11.51) v1(0.59,8.97) v1(0.59,6.43) v1(0.59,3.89) v1(2.71,10.02) v1(2.69,9.16) v1(3.53,10.01) v1(3.53,9.16) v1(3.82,0.62) v1(4.03,69.41) v1(6.36,0.62) v1(6.57,69.41) v1(7.45,50.58) v1(7.88,55.34) v1(7.97,22.55) v1(7.96,21.94) v1(8.9,0.62) v1(9.32,24.47) v1(10.22,24.47) v1(11.16,24.46) v1(11.2,2.96) v1(11.18,1.47) v1(11.44,0.62) v1(11.56,8.45) v1(12.13,24.46) v1(12.15,5.19) v1(13.14,24.49) v1(13.06,2.99) v1(13.07,1.47) v1(13.86,55.66) v1(13.98,0.62) v1(14.05,24.5) v1(14.19,69.41) v1(14.48,68.26) v1(14.48,67.16) v1(14.68,14.54) v1(16.01,68.28) v1(16.01,67.15) v1(16.52,0.62) v1(16.6,20.47) v1(16.73,69.41) v1(17.65,68.29) v1(17.65,67.12) v1(18.73,3.43) v1(18.7,2.81) v1(19.65,8) v1(19.66,7.25) v1(20.51,8.02) v1(20.51,7.25) v1(21.26,63.48) v1(21.32,17.37) v1(22.85,0.62) v1(23.77,3.48) v1(23.76,2.81) v1(24.35,69.41) v1(24.8,8.01) v1(24.8,7.25) v1(25.69,8.01) v1(25.69,7.26) v1(25.91,68.54) v1(25.92,67.39) v1(26.61,10.46) v1(26.61,9.69) v1(27.3,10.47) v1(27.32,9.69) v1(29.43,69.41) v1(29.52,4.29) v1(29.48,3.1) v1(29.48,1.99) v1(29.48,0.88) v1(30.25,67.8) v1(30.24,66.58) v1(31.01,65.01) v1(31.2,4.3) v1(31.18,3.1) v1(31.15,1.99) v1(31.18,0.88) v1(31.76,0.62) v1(31.97,69.41) v1(32.53,67.84) v1(32.52,66.56) v1(32.89,3.12) v1(32.89,2.01) v1(32.91,0.86) v1(32.97,4.29) v1(33.33,12.29) v1(33.33,11.71) v1(33.34,11.1) v1(33.86,21.45) v1(33.86,20.8) v1(34.58,4.31) v1(34.59,3.12) v1(34.58,2.05) v1(34.59,0.88) v1(35.44,51.31) v1(36.84,0.62) v1(37.05,69.41) v1(37.24,63.04) v1(37.33,11.36) v1(37.37,14.18) v1(37.35,12.85) v1(37.84,10.27) v1(37.92,62.32) v1(38.88,10.27) v1(39.38,0.62) v1(39.59,69.41) v1(44.6,64.02) v1(44.6,61.48) v1(44.6,58.94) v1(44.6,56.4) v1(44.6,53.86) v1(44.6,51.32) v1(44.6,48.78) v1(44.6,46.24) v1(44.6,43.7) v1(44.6,41.16) v1(44.6,38.62) v1(44.6,36.08) v1(44.6,33.54) v1(44.6,31) v1(44.6,28.46) v1(44.6,25.92) v1(44.6,23.38) v1(44.6,20.84) v1(44.6,18.3) v1(44.6,15.76) v1(44.6,13.22) v1(44.6,10.68) v1(44.6,8.14) v1(44.6,5.6)
VCCPLLL: length 3.4
  Top Layer w0.381: 29.21,36.13 29.21,36.21 v1(29.62,36.62)
  Bottom Layer w0.381: 30.68,35.48 30.2,35.97 30.2,36.05 v1(29.62,36.62) 29.24,37 L12.2
VCCPLLR: length 4.3
  Top Layer w0.381: v1(25.72,32.6) 26.21,33.09 26.21,33.13
  Bottom Layer w0.381: 26.16,32.94 25.82,32.6 v1(25.72,32.6) 25.45,32.33 ; 26.16,32.94 26.62,32.48 C131.2 ; 26.16,32.94 26.14,32.96 ; 25.45,32.33 25.37,32.25 25.12,32.25 L13.2 ; 25.45,32.33 C130.2
A6_IOR26B_JTAG_TDI: length 3.6
  Top Layer w0.158: U20.4 16.51,62.98 TP14.1 16.42,62.7 15.83,62.11 RN1.4
A7_IOR26A_JTAG_TCK: length 12.1
  Top Layer w0.158: RN1.3 15.33,62.82 v1(15.26,62.89) 15.51,63.13 U20.5
  Bottom Layer w0.158: v1(15.26,62.89) 15.29,62.86 15.29,61.62 14.99,61.32 8.19,61.32 R20.2
A13_IOR32A_READY: length 4.7
  Top Layer w0.158: U7.A13 32.2,45.75 31.68,46.27 R137.2
B8_IOR25B_JTAG_TMS: length 4.9
  Top Layer w0.158: RN1.1 13.07,61.41 12.89,61.59 TP11.1 13.51,63.54 U20.7
B10_IOR31B_RECFG: length 7.5
  Top Layer w0.158: 30.92,46.63 30.91,46.62 30.91,46.03 30.51,45.64 30.51,43.24 30.4,43.12 28.87,43.12 28.71,42.96 28.71,41.63 29.2,41.13 U7.B10
B16_MODE1: length 6.8
  Top Layer w0.109: 35.21,41.13 35.21,41.15 v1(35.65,41.59)
  Top Layer w0.158: v1(35.65,41.59) 36.08,42.02 36.08,43.3 35.82,43.56 35.13,43.56 34.97,43.72 34.97,46.47 34.81,46.63
BOOT0: length 13.4
  Top Layer w0.158: v1(21.35,59.7) 20.36,59.7 SW5.1 19.75,60.31 R4.2 ; U1.44 25.42,54.07 v1(25.43,54.08)
  Bottom Layer w0.158: v1(25.43,54.08) 25.57,54.22 25.57,57.65 25.41,57.8 21.51,57.8 21.35,57.96 v1(21.35,59.7)
C6_IOR25A_JTAG_TDO: length 3.8
  Top Layer w0.158: RN1.2 14.83,62.16 TP12.1 14.51,63.3 U20.6
C10_IOR39A: length 26.5
  Top Layer w0.109: 29.21,40.13 v1(29.71,40.63)
  Top Layer w0.158: R172.2 v1(21.25,19.3)
  SIN2 w0.158: v1(21.25,19.3) 21.25,24.15 25.23,28.13 25.23,31.02 25.11,31.15 25.11,32.78 25.36,33.03 25.59,33.03 28.91,36.36 28.91,36.58 29.4,37.07 29.4,40.32 v1(29.71,40.63)
C13_IOR32B_DONE: length 6.8
  Top Layer w0.158: R138.2 32.46,46.21 32.73,45.95 32.73,40.64 U7.C13
C15_MODE2: length 7.2
  Top Layer w0.158: U7.C15 34.26,40.17 34.26,40.42 34.69,40.85 34.69,43.56 34.66,43.59 34.66,43.82 34.56,43.92 34.2,43.92 34.06,44.06 34.06,46.59 34.02,46.63
D11_IOL22A: length 55.4
  Top Layer w0.109: 30.21,39.13 30.21,39.03 v1(29.83,38.65)
  Top Layer w0.158: 27.62,17.29 27.37,17.29 ; 27.62,17.29 27.8,17.29 ; 27.62,17.29 27.78,17.13 ; 27.4,13.36 27.61,13.36 ; 27.61,13.36 27.78,13.53 ; 27.61,13.36 27.78,13.36 ; 27.8,17.29 27.78,17.28 27.78,17.13 ; 27.8,17.29 27.95,17.29 ; 27.78,13.53 27.78,16.32 ; 27.78,13.53 27.78,13.52 ; 27.78,17.12 27.78,17.13 ; 27.78,17.12 27.78,16.65 ; 27.78,17.12 27.95,17.29 ; 27.78,16.32 27.78,16.53 ; 27.78,16.32 27.63,16.47 ; v1(28.69,18.9) 28.69,17.87 SW2.2 28.67,17.7 28.26,17.29 27.95,17.29 ; 27.6,16.47 27.78,16.65 ; 27.6,16.47 27.63,16.47 ; 27.6,16.47 D6.2 ; 27.78,16.65 27.78,16.53 ; 27.78,13.52 27.95,13.36 ; 27.78,13.52 27.78,13.36 ; 27.95,13.36 28.67,13.36 SW2.1 ; 27.95,13.36 27.78,13.36 ; 27.78,16.53 27.73,16.47 27.63,16.47
  SIN1 w0.158: v1(29.76,33.57) 23.49,33.57 23.28,33.36 23.28,26.91 22.06,25.69 ; 22.05,25.69 22.06,25.69 ; 22.06,25.69 20.9,25.69 20.58,25.36 20.58,20.68 20.34,20.44 17.98,20.44 17.82,20.29 17.82,17.42 18.01,17.23 19.74,17.23 19.86,17.35 19.86,18.31 20.02,18.47 28.26,18.47 v1(28.69,18.9)
  SIN2 w0.158: v1(29.83,38.65) 30.17,38.65 30.34,38.48 30.34,35.58 29.76,34.99 v1(29.76,33.57)
